# EasyEDA Pro project control_board.eprj

# Schematic Schematic1

## Sheets
1 P1: Board Name: Board1; Create Date: 2025-07-01; Page Name: P1; Project Name: control_board; Schematic Name: Schematic1; Update Date: 2025-07-02; Company: 嘉立创EDA; Page Size: A4; Version: V1.0
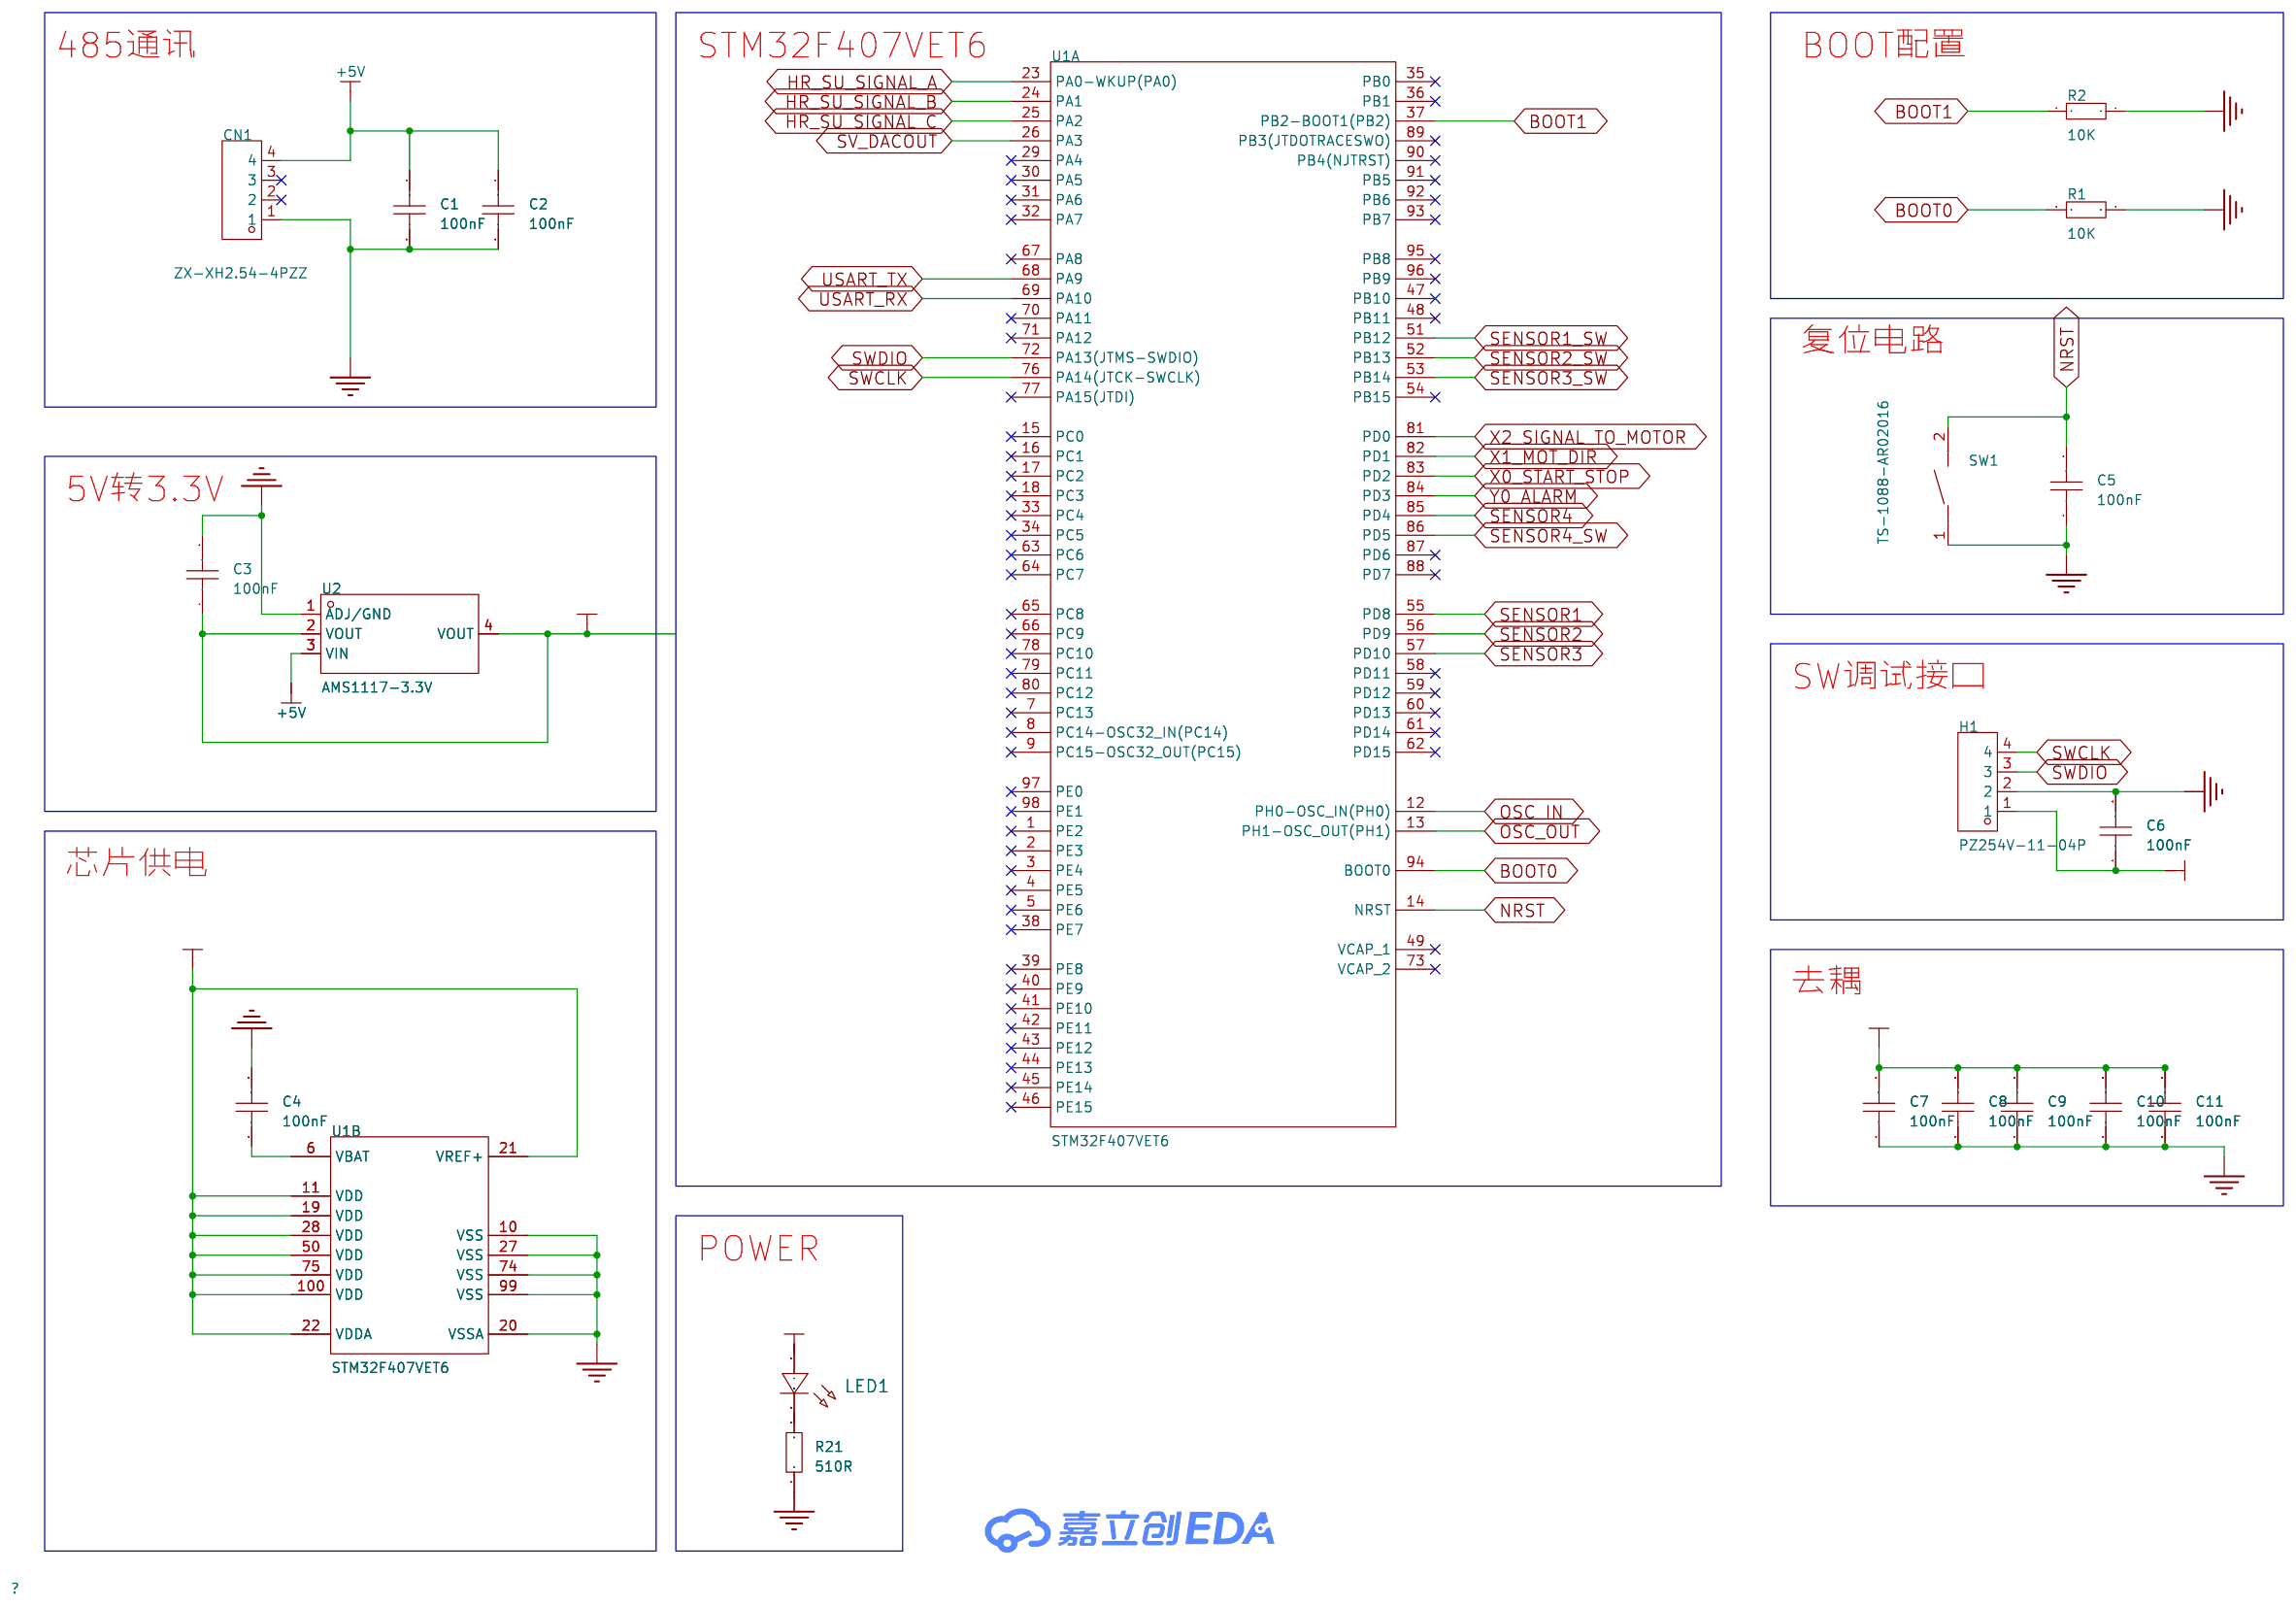
[diagram p0: P1]
2 P2: Page Name: P2
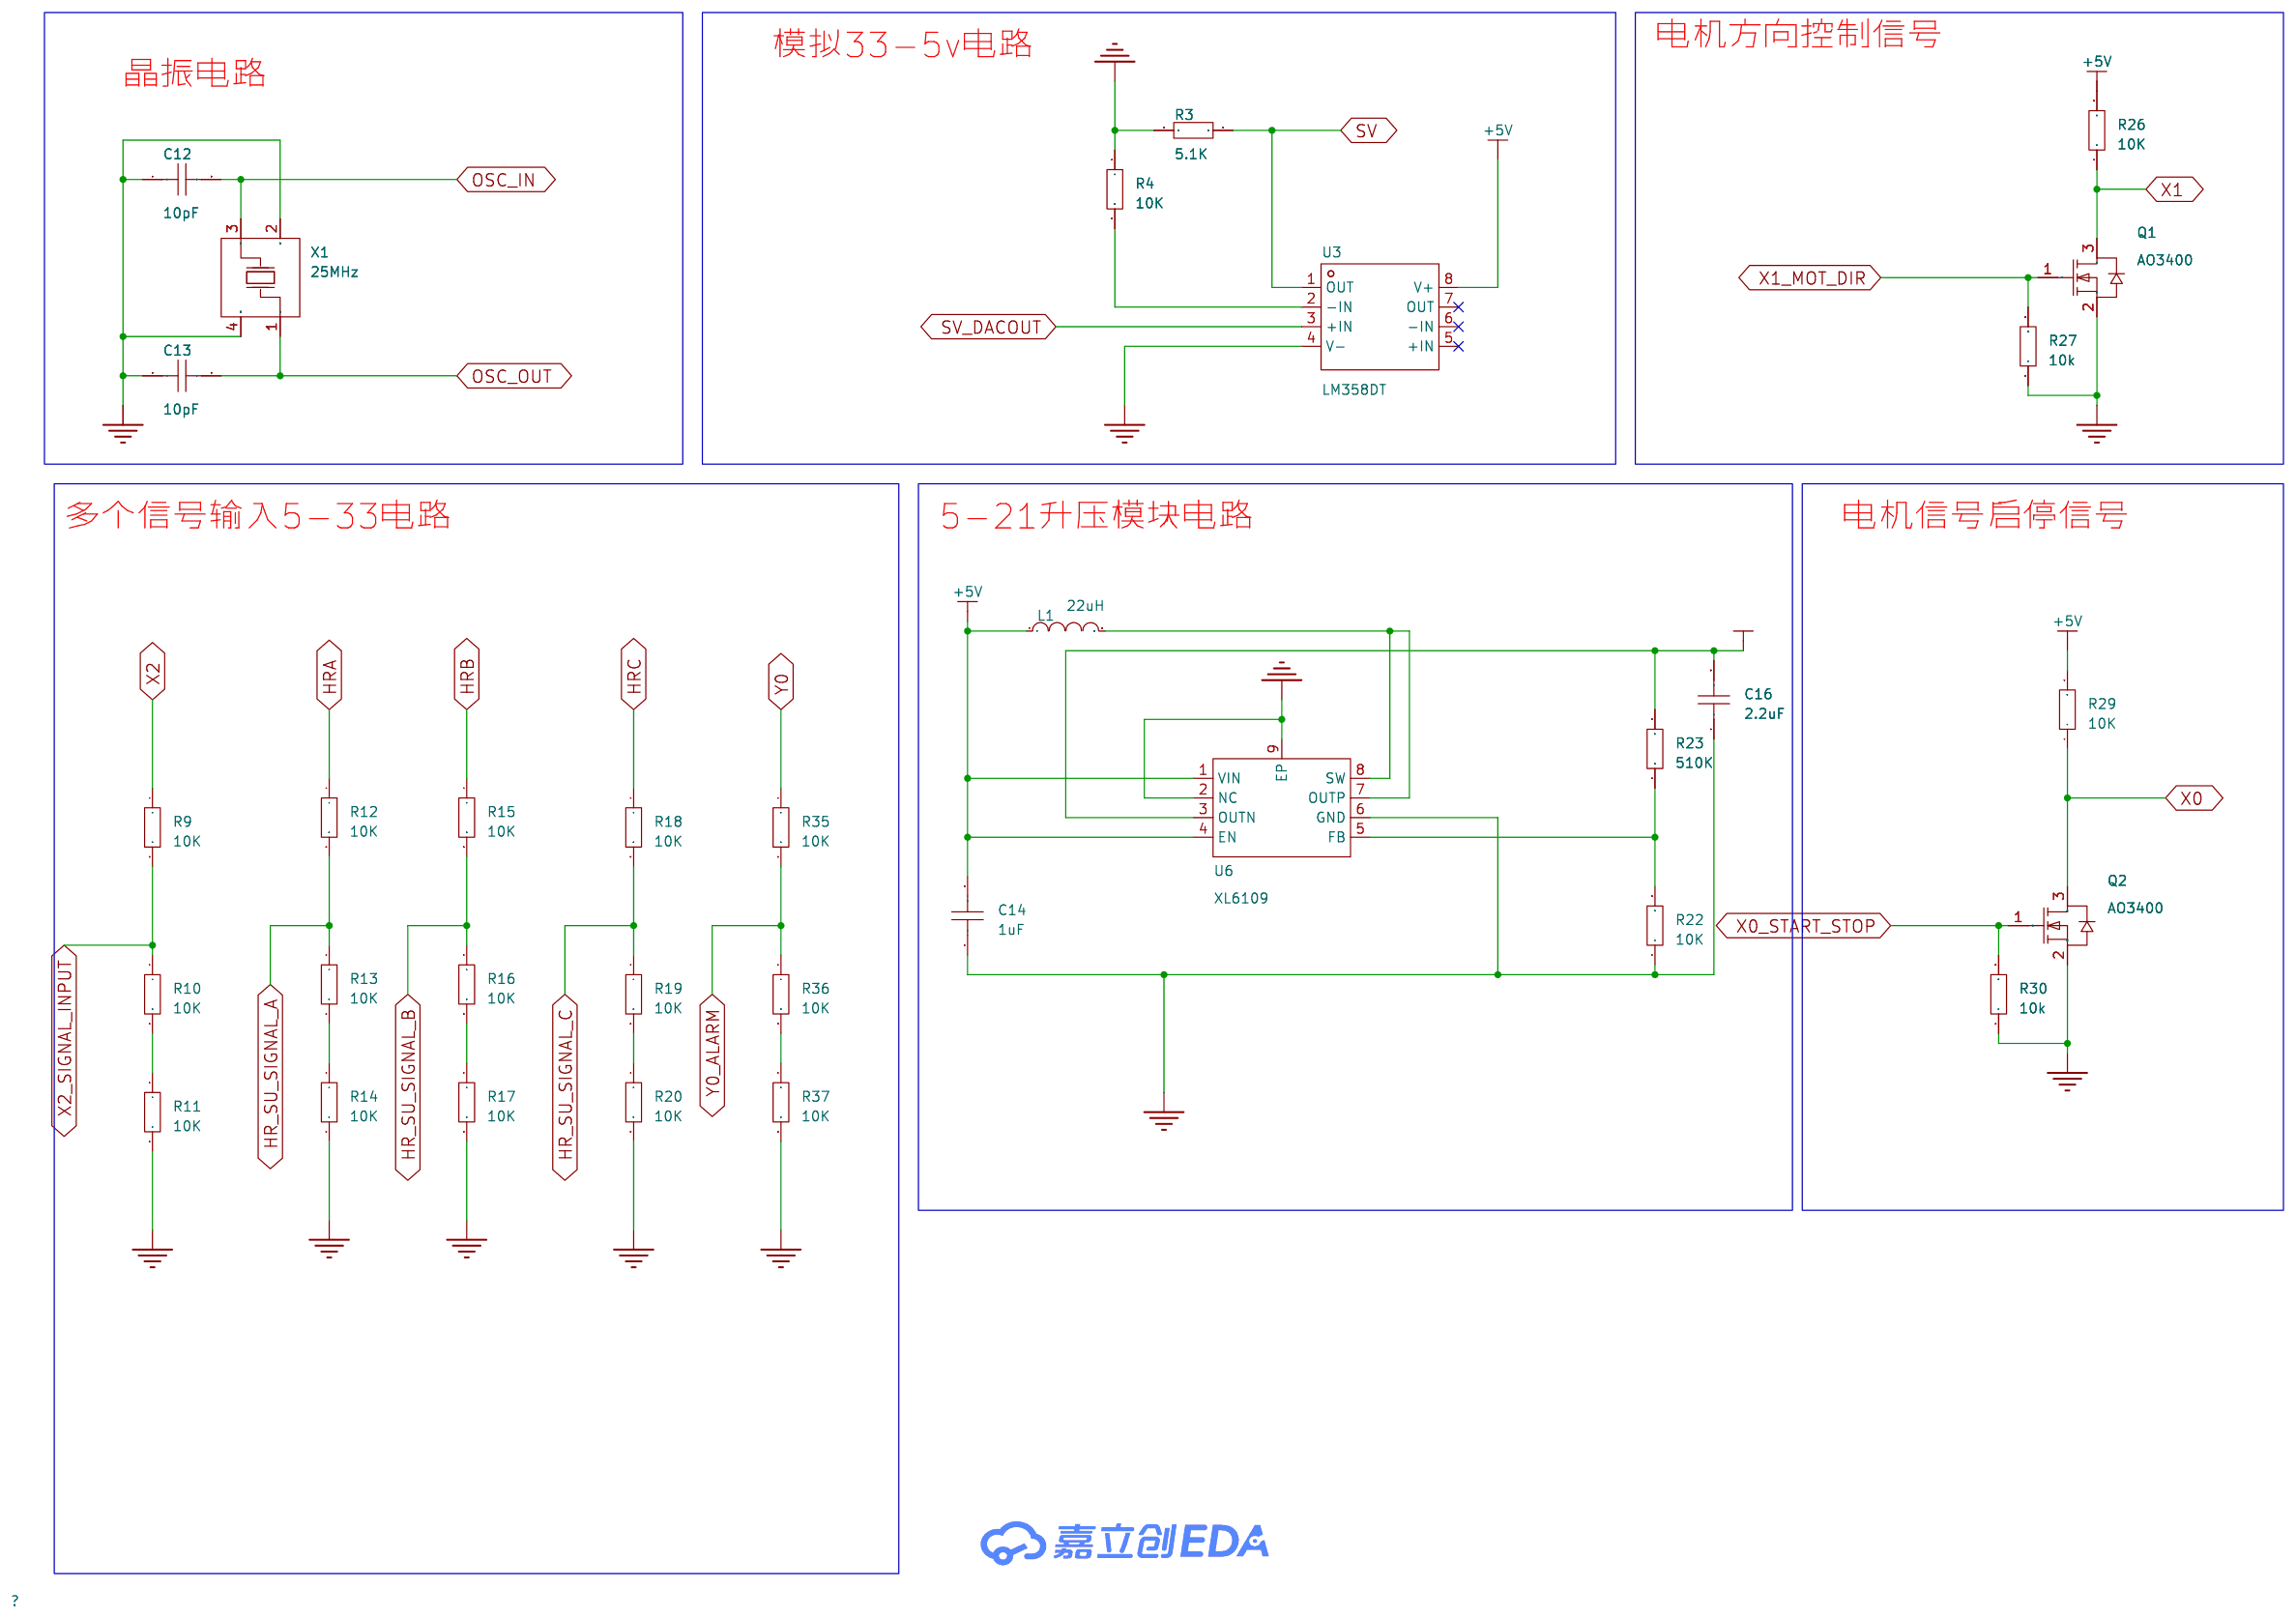
[diagram p1: P2]
3 P3: Create Date: 2025-07-02; Page Name: P3
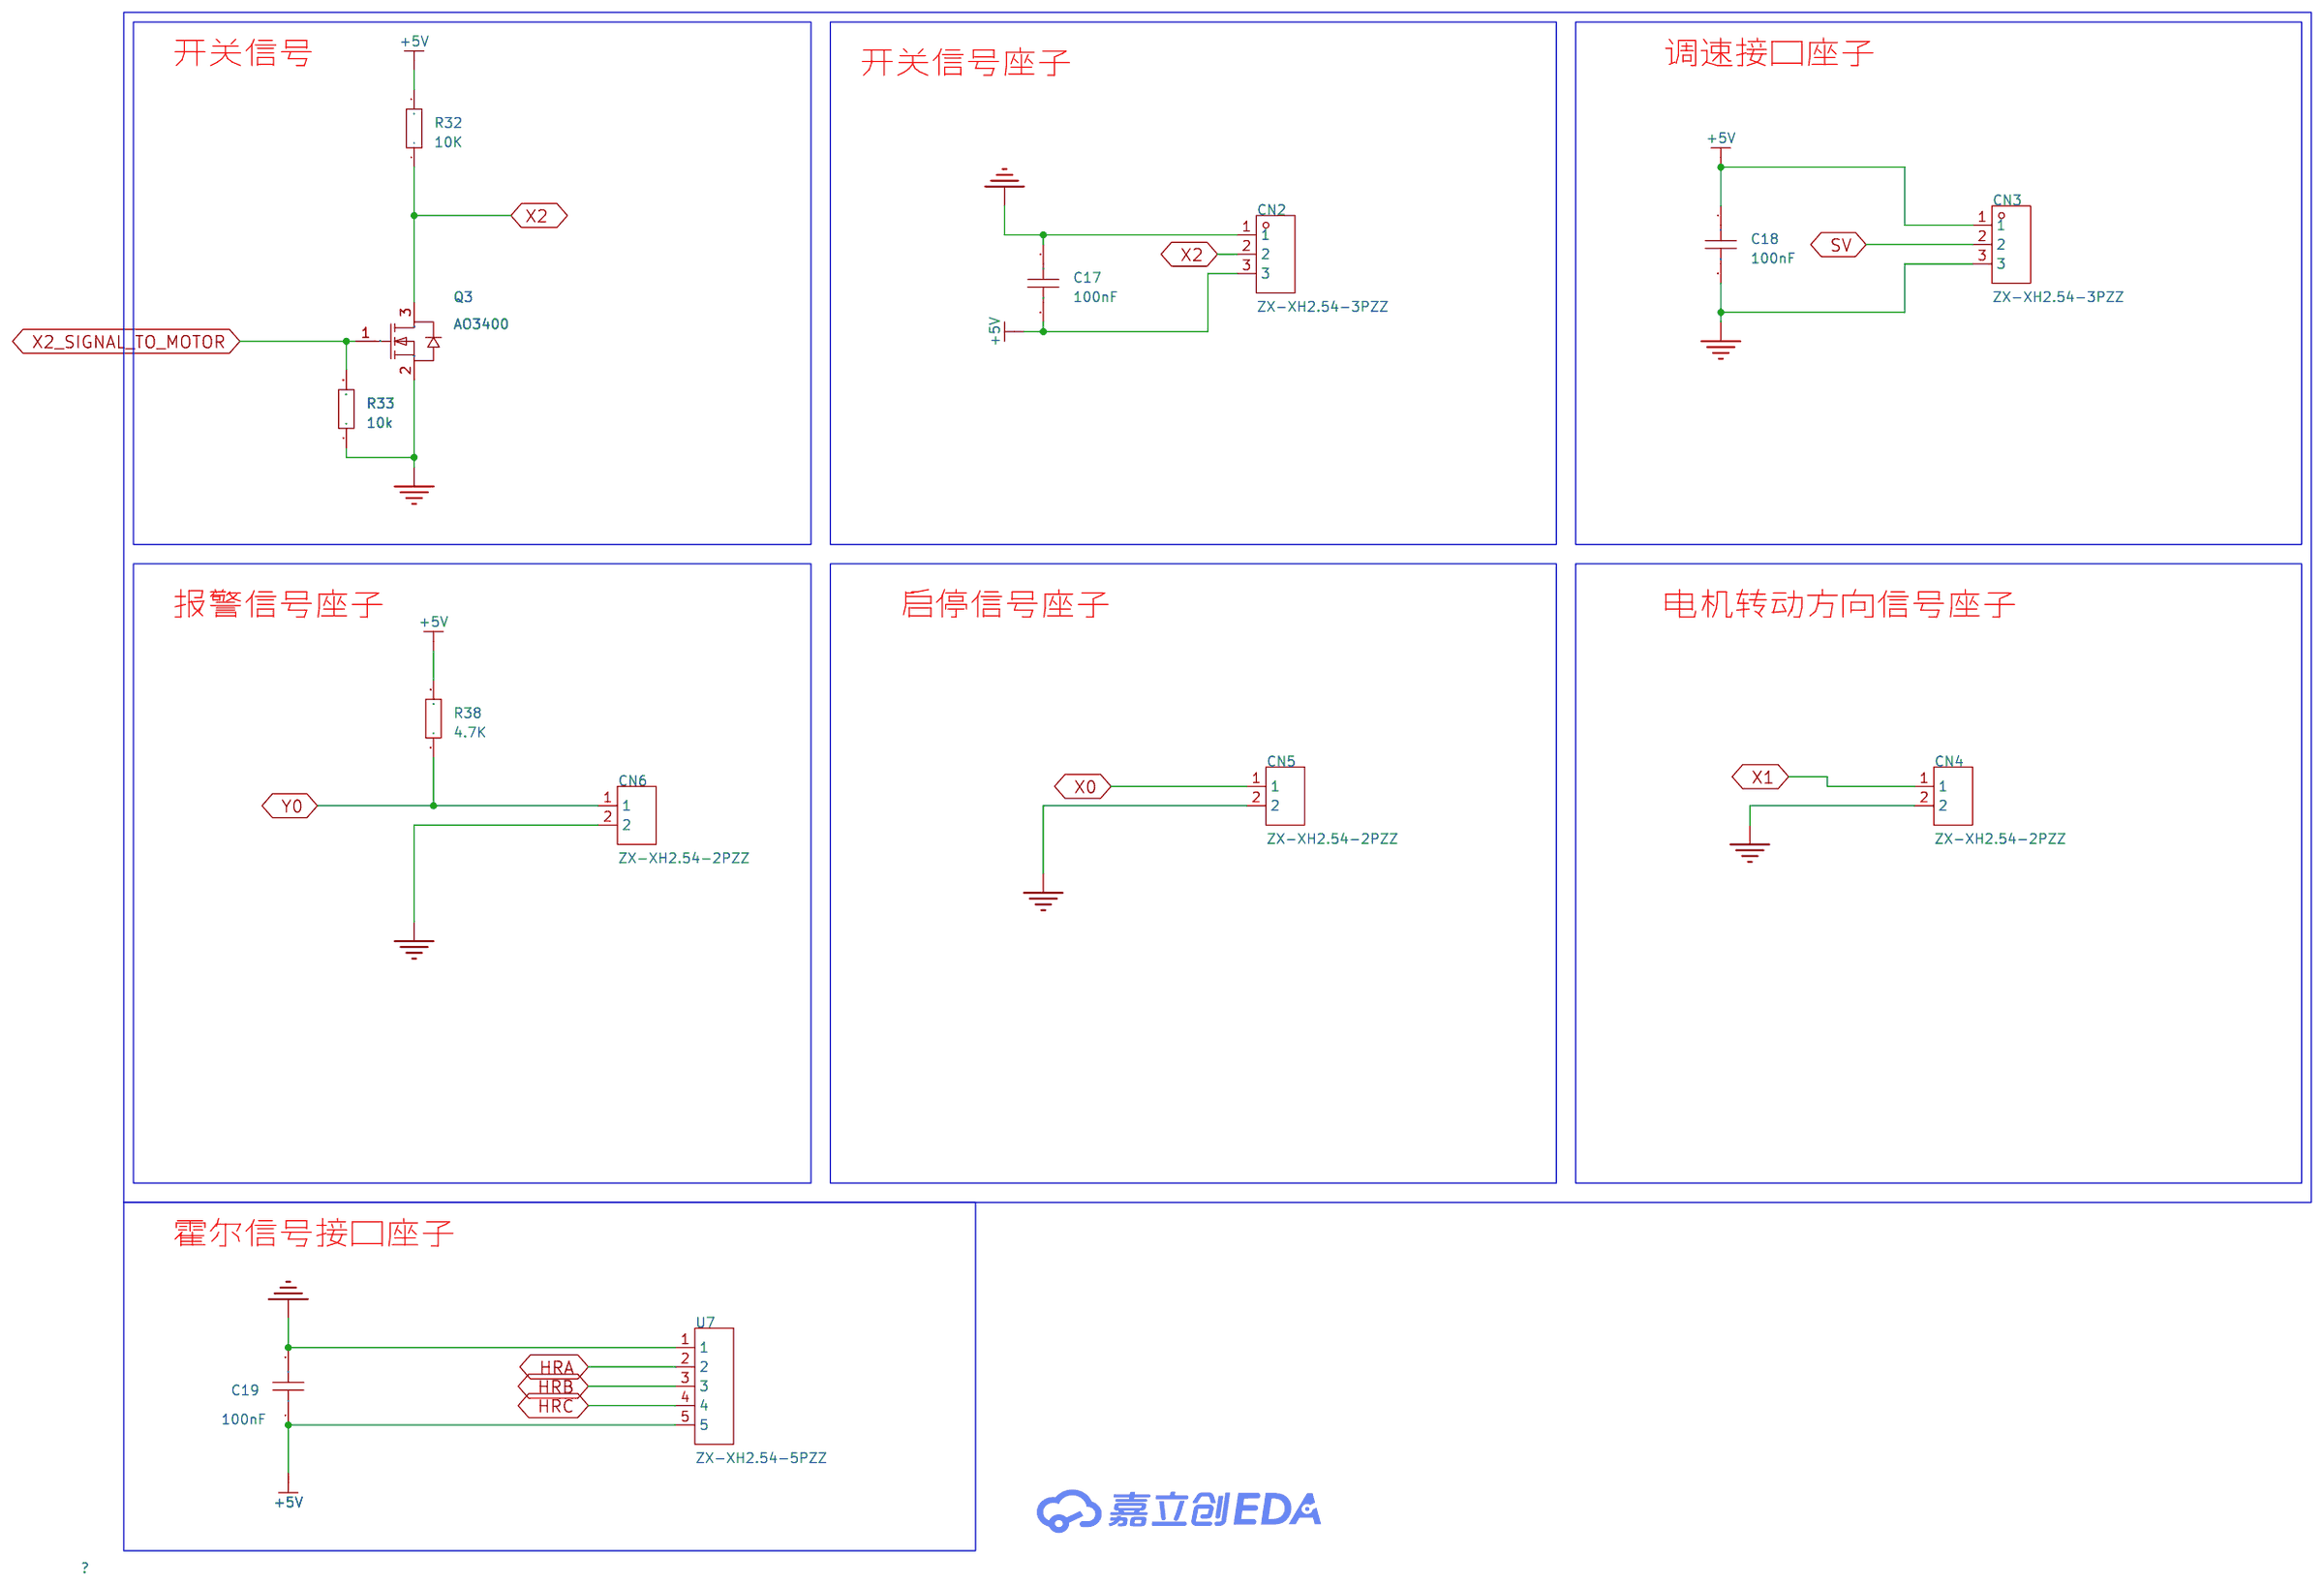
[diagram p2: P3]
4 P4: Create Date: 2025-07-02; Page Name: P4; Update Date: 2025-07-03
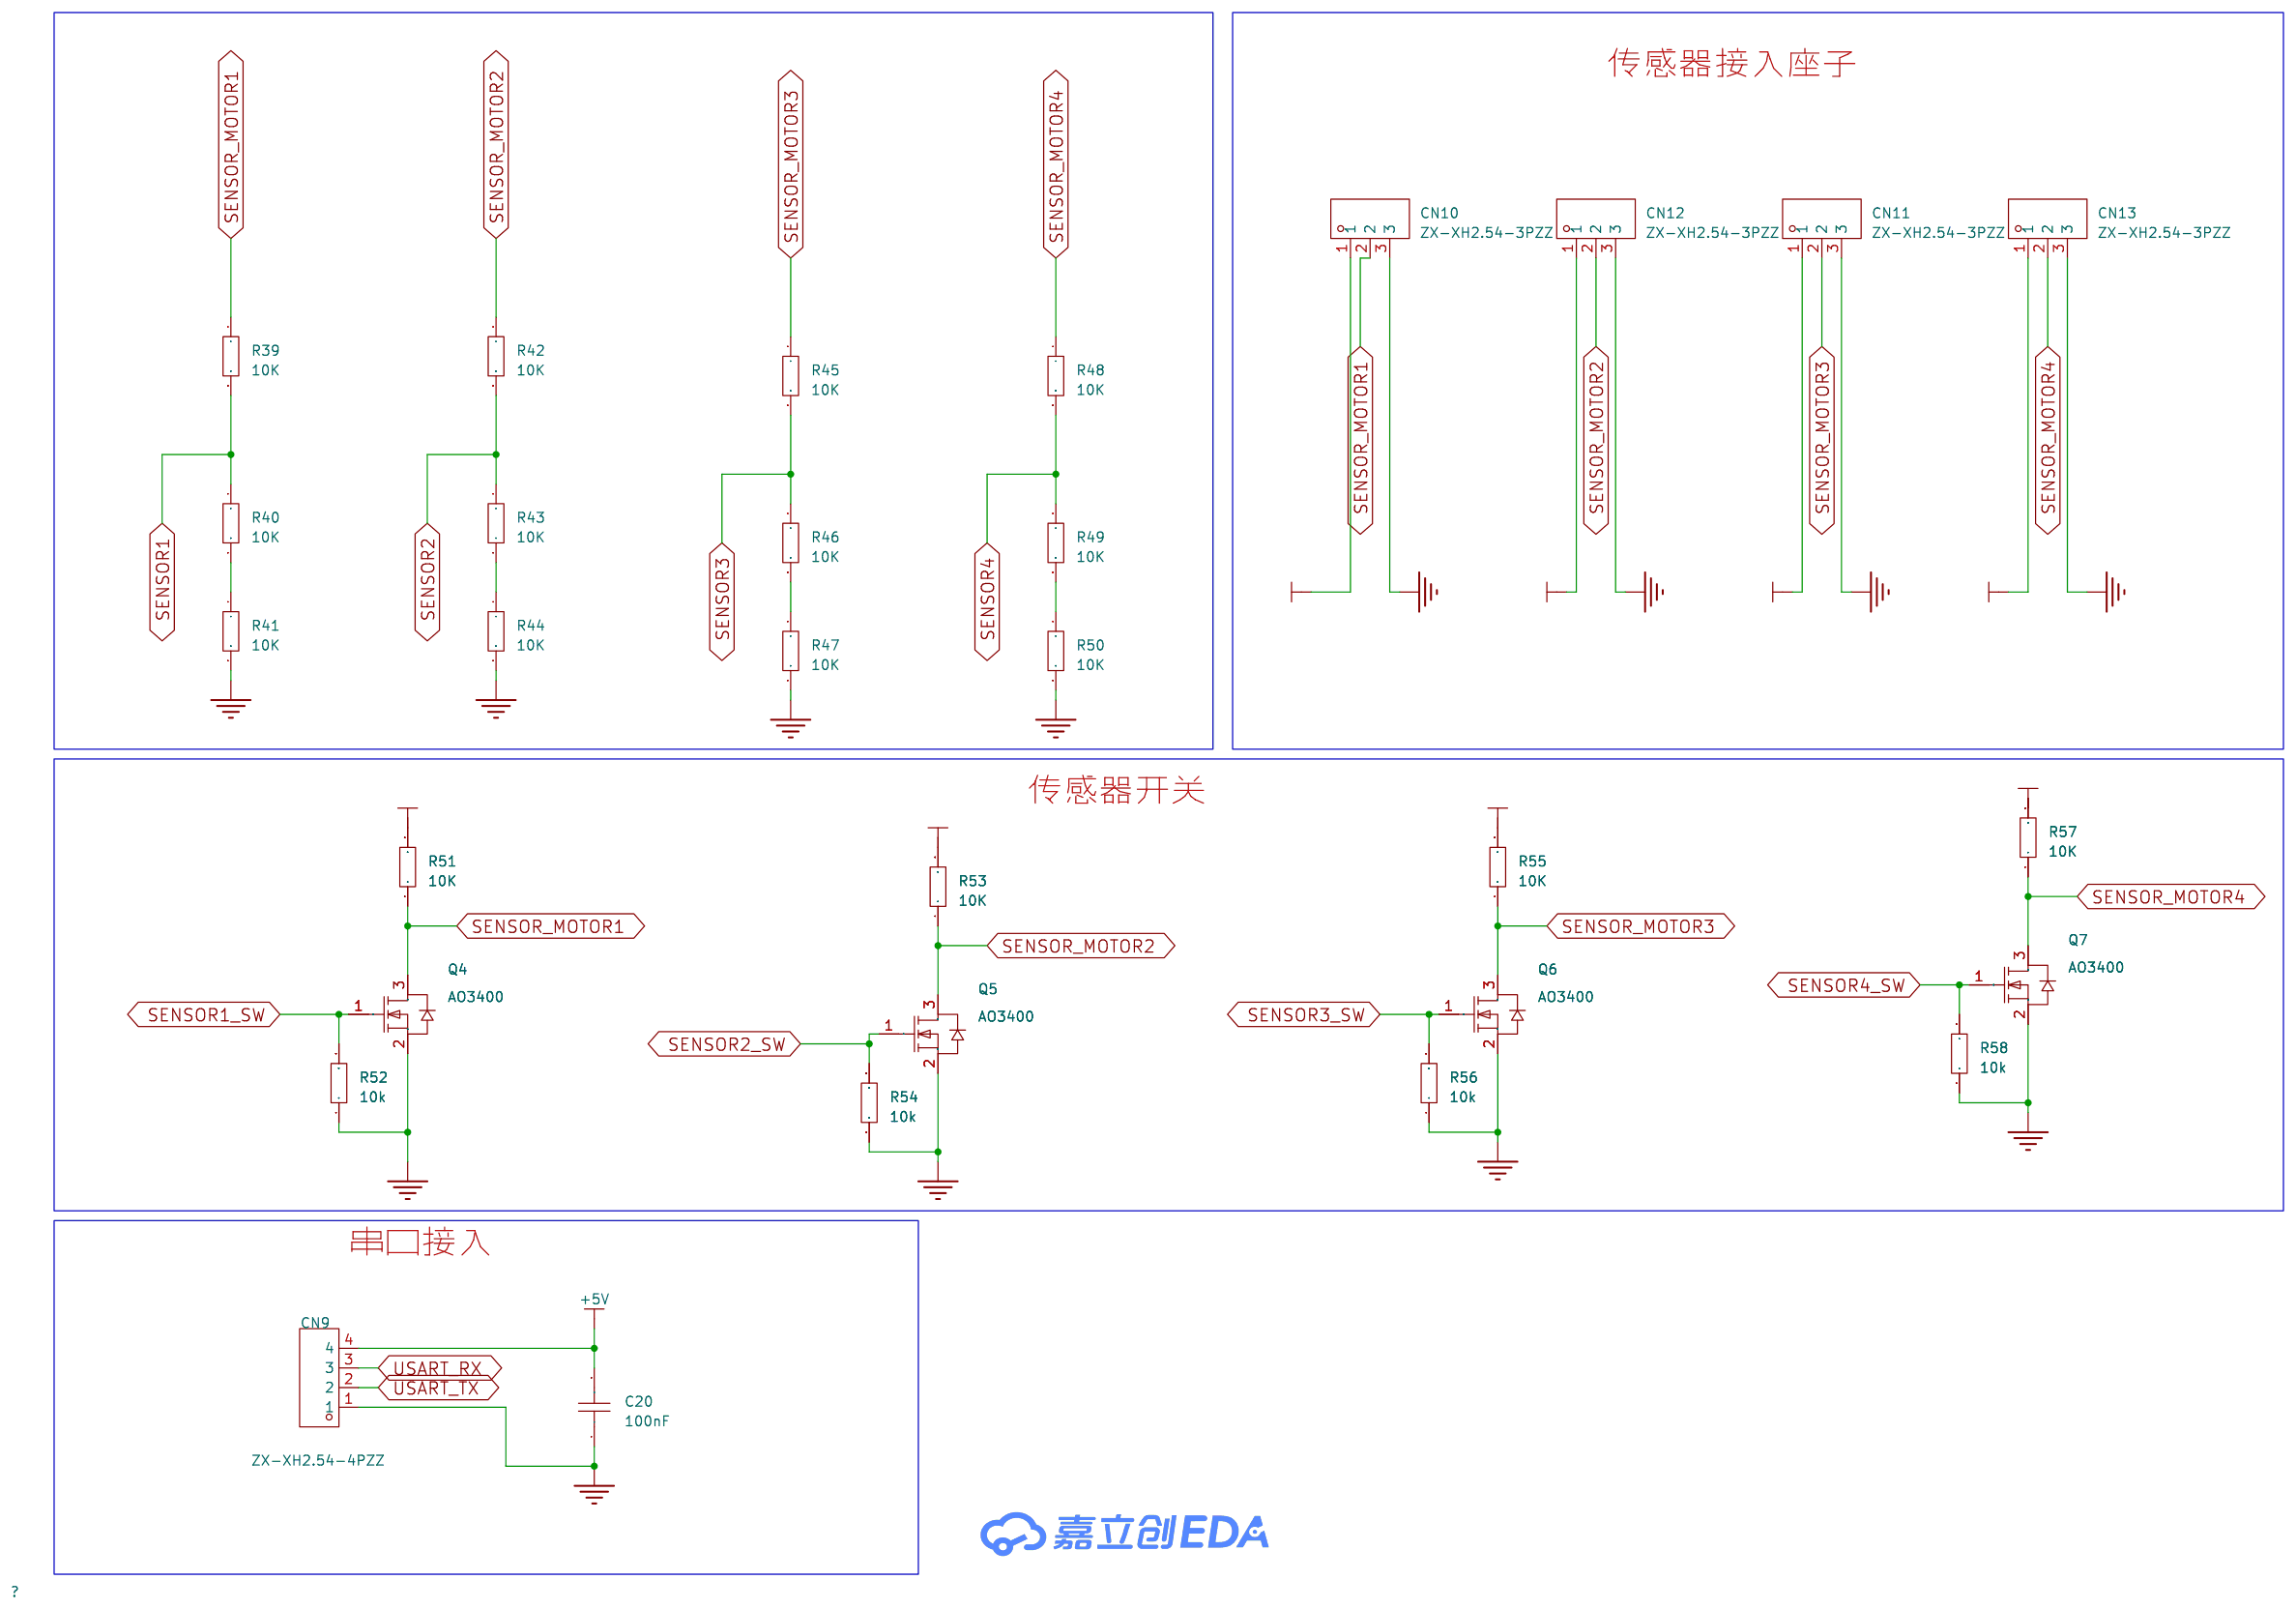
[diagram p3: P4]

## Parts
sheet P1
C1  100nF  [C0603]
C2  100nF  [C0603]
C3  100nF  [C0603]
C4  100nF  [C0603]
C5  100nF  [C0603]
C6  100nF  [C0603]
C7  100nF  [C0603]
C8  100nF  [C0603]
C9  100nF  [C0603]
C10  100nF  [C0603]
C11  100nF  [C0603]
CN1  ZX-XH2.54-4PZZ  [CONN-TH_4P-P2.50_4PIN]
H1  PZ254V-11-04P  [HDR-TH_4P-P2.54-V-M]
LED1  -  [LED_0603]
R1  10K  [R0603]
R2  10K  [R0603]
R21  510R  [R0603]
SW1  TS-1088-AR02016  [SW-SMD_L3.9-W3.0-P4.45]
U1  STM32F407VET6  [LQFP-100_L14.0-W14.0-P0.50-LS16.0-BL]  (sections 1,2)
U2  AMS1117-3.3V  [SOT-223-4_L6.5-W3.5-P2.30-LS7.0-TR]
sheet P2
C12  10pF  [C0603]
C13  10pF  [C0603]
C14  1uF  [C0603]
C16  2.2uF  [C0603]
L1  22uH  [L0603]
Q1  AO3400  [SOT-23_L2.9-W1.3-P1.90-LS2.4-BR]
Q2  AO3400  [SOT-23_L2.9-W1.3-P1.90-LS2.4-BR]
R3  5.1K  [R0603]
R4  10K  [R0603]
R9  10K  [R0603]
R10  10K  [R0603]
R11  10K  [R0603]
R12  10K  [R0603]
R13  10K  [R0603]
R14  10K  [R0603]
R15  10K  [R0603]
R16  10K  [R0603]
R17  10K  [R0603]
R18  10K  [R0603]
R19  10K  [R0603]
R20  10K  [R0603]
R22  10K  [R0603]
R23  510K  [R0603]
R26  10K  [R0603]
R27  10k  [R0603]
R29  10K  [R0603]
R30  10k  [R0603]
R35  10K  [R0603]
R36  10K  [R0603]
R37  10K  [R0603]
U3  LM358DT  [SOIC-8_L5.0-W4.0-P1.27-LS6.0-BL]
U6  XL6109  [DFN-8_L3.0-W3.0-P0.50-TL-EP2.1]
X1  25MHz  [CRYSTAL-SMD_4P-L3.2-W2.5-BL]
sheet P3
C17  100nF  [C0603]
C18  100nF  [C0603]
C19  100nF  [C0603]
CN2  ZX-XH2.54-3PZZ  [CONN-TH_3P-P2.54_2501S-3P]
CN3  ZX-XH2.54-3PZZ  [CONN-TH_3P-P2.54_2501S-3P]
CN4  ZX-XH2.54-2PZZ  [CONN-TH_2P-P2.50_HX25003-2A]
CN5  ZX-XH2.54-2PZZ  [CONN-TH_2P-P2.50_HX25003-2A]
CN6  ZX-XH2.54-2PZZ  [CONN-TH_2P-P2.50_HX25003-2A]
Q3  AO3400  [SOT-23_L2.9-W1.3-P1.90-LS2.4-BR]
R32  10K  [R0603]
R33  10k  [R0603]
R38  4.7K  [R0603]
U7  ZX-XH2.54-5PZZ  [CONN-TH_5P-P2.50_ZX-XH2.54-5PZZ]
sheet P4
C20  100nF  [C0603]
CN9  ZX-XH2.54-4PZZ  [CONN-TH_4P-P2.50_4PIN]
CN10  ZX-XH2.54-3PZZ  [CONN-TH_3P-P2.54_2501S-3P]
CN11  ZX-XH2.54-3PZZ  [CONN-TH_3P-P2.54_2501S-3P]
CN12  ZX-XH2.54-3PZZ  [CONN-TH_3P-P2.54_2501S-3P]
CN13  ZX-XH2.54-3PZZ  [CONN-TH_3P-P2.54_2501S-3P]
Q4  AO3400  [SOT-23_L2.9-W1.3-P1.90-LS2.4-BR]
Q5  AO3400  [SOT-23_L2.9-W1.3-P1.90-LS2.4-BR]
Q6  AO3400  [SOT-23_L2.9-W1.3-P1.90-LS2.4-BR]
Q7  AO3400  [SOT-23_L2.9-W1.3-P1.90-LS2.4-BR]
R39  10K  [R0603]
R40  10K  [R0603]
R41  10K  [R0603]
R42  10K  [R0603]
R43  10K  [R0603]
R44  10K  [R0603]
R45  10K  [R0603]
R46  10K  [R0603]
R47  10K  [R0603]
R48  10K  [R0603]
R49  10K  [R0603]
R50  10K  [R0603]
R51  10K  [R0603]
R52  10k  [R0603]
R53  10K  [R0603]
R54  10k  [R0603]
R55  10K  [R0603]
R56  10k  [R0603]
R57  10K  [R0603]
R58  10k  [R0603]

## Library data of the parts
C1-C14 C16-C20 = CAP_0603: Supplier Footprint: 0603
CN1 CN9 = ZX-XH2.54-4PZZ: LCSC Part Name: 1x4P 间距:2.5mm 直插 系列:XH; Supplier Part: C7429634; Manufacturer: Megastar(兆星); Supplier Footprint: 插件,P=2.5mm; JLCPCB Part Class: 扩展库; Datasheet: https://atta.szlcsc.com/upload/public/pdf/source/20230619/B529A2163E0159A644AB3383D208FB03.pdf; Supplier: LCSC; Pins Structure: 1x4P; Pitch: 2.5mm; Mounting Type: 直插; Reference Series: XH; Number of Pins: 4P; Number of Rows: 1; Number of PINs Per Row: 4; Rated Current: 3A; Contact Material: 黄铜; Contact Plating: 锡; Operating Temperature: -25℃~+85℃; Rated Voltage (Max): 250V; Plastic Material: PA66; Flame Retardant Rating: UL94V-0; Color: 白色; Z-Height of the Board: 7mm; X-Length of Bottom Edge on Board (Spacing Line): 12.5mm; Y-Width of Bottom Edge on Board: 5.9mm
H1 = PZ254V-11-04P: LCSC Part Name: 间距:2.54mm 1x4P 直插 方针; Supplier Part: C2691448; Manufacturer: XFCN(兴飞); Supplier Footprint: 插件,P=2.54mm; JLCPCB Part Class: 扩展库; Datasheet: https://atta.szlcsc.com/upload/public/pdf/source/20200309/C492403_F9F19131791D08044AD4F84F8E751A34.pdf; Supplier: LCSC; Pin Structure: 1x4P; Pitch: 2.54mm; Circluar Pins/Square Pins: 方针; Mounting Type: 直插; Number of Rows: 单排; Number of Pins: 4P; Current Rating (Max): 3A; Voltage Rating (Max): 250V; Length of Mating Pin: 6mm; Insulation Height: 2.5mm; Length of End Connection Pin: 3mm; Operating Temperature Range: -40℃~+105℃; Color: 黑色
LED1 = LED_0603-R: Supplier Footprint: 0603
R1-R4 R9-R23 R26 R27 R29 R30 R32 R33 R35-R58 = Res_0603: Supplier Footprint: 0603
SW1 = TS-1088-AR02016: LCSC Part Name: 4*3*2mm 立贴 轻触开关; Supplier Part: C720477; Manufacturer: XUNPU(讯普); Supplier Footprint: SMD; JLCPCB Part Class: 基础库; Datasheet: https://atta.szlcsc.com/upload/public/pdf/source/20200810/C720475_60D09DD6C54279ADDB2DC25100F1CC11.pdf; Supplier: LCSC; Circuit: 单刀单掷; Actuator Style: 圆形按钮; Operating Force: 160gf; Mounting Style: 立贴; Switch Length: 4mm; Switch Width: 3mm; Switch Height: 2mm; Strike Gundam: 不带; Contact Current: 50mA; Voltage Rating (DC): 12V; Insulation Resistance: 100MΩ; Actuator/Cap Color: 黑色; Pin Style: SMD接片; Mechanical Life: 10万次; Operating Temperature: -30℃~+80℃
U1 = STM32F407VET6: LCSC Part Name: 带DSP和FPU的高性能基础系列ARM Cortex-M4 MCU，具有512 KB Flash、168 MHz CPU、ART加速器、以太网和FSMC; Supplier Part: C28730; Manufacturer: ST(意法半导体); Supplier Footprint: LQFP-100(14x14); JLCPCB Part Class: 扩展库; Datasheet: https://atta.szlcsc.com/upload/public/pdf/source/20140801/1457707197138.pdf; Supplier: LCSC; CPU Core: ARM-M4; CPU Maximum Speed: 168MHz; Program Storage Size: 512KB; Program Memory Type: FLASH; Number of I/O: 82; ADC (Bit): 12bit; DAC (Bit): 12bit; Voltage - Supply: 1.8V~3.6V
U2 = AMS1117-3.3V: LCSC Part Name: 输入18V 输出3.3V 1A; Supplier Part: C5120765; Manufacturer: MSKSEMI(美森科); Supplier Footprint: SOT-223; JLCPCB Part Class: 扩展库; Datasheet: https://atta.szlcsc.com/upload/public/pdf/source/20230802/7000FCAFF33971783A269E7BD69EFE08.pdf; Supplier: LCSC; Output Type: 固定; Maximum Input Voltage: 18V; Output Voltage: 3.3V; MAX Output Current: 1A; Dropout Voltage: 1.4V@(1A); standby current: 12mA; Operating Temperature: 0℃~+125℃; Output Polarity: 正极; Number of Outputs: 1
L1 = L_0603
Q1-Q7 = AO3400_C2938367: LCSC Part Name: 1个N沟道 耐压:30V 电流:5.8A; Supplier Part: C2938367; Manufacturer: GOODWORK(固得沃克); Supplier Footprint: SOT-23; JLCPCB Part Class: 扩展库; Datasheet: https://atta.szlcsc.com/upload/public/pdf/source/20240805/AF56525E67E43DBB802F95DDDF058BE9.pdf; Supplier: LCSC; Type: 1个N沟道; Drain to Source Voltage: 30V; Current - Continuous Drain(Id): 5.8A; RDS(on): 52mΩ@2.5V,4A; Pd - Power Dissipation: 1.5W; Gate Threshold Voltage (Vgs(th)@Id): 700mV; Input Capacitance(Ciss@Vds): 1.05nF; Reverse Transfer Capacitance (Crss@Vds): 77pF; Operating Temperature: -55℃~+150℃
U3 = LM358DT: LCSC Part Name: 低功耗双运算放大器，低输入偏置电流; Supplier Part: C9418; Manufacturer: ST(意法半导体); Supplier Footprint: SOIC-8; JLCPCB Part Class: 扩展库; Datasheet: https://atta.szlcsc.com/upload/public/pdf/source/20210324/C2649392_3AC2EBDF95F7F5F1B944475B4862C799.pdf; Supplier: LCSC; Number of Channels: 双路; Maximum Power Supply Range (Vdd-Vss): 32V; Vos - Input Offset Voltage: 7mV; Input Offset Voltage Drift(Vos TC): 30uV/℃; Slew Rate: 600V/ms; Ib - Input Bias Current: 200nA; Noise density(eN): 55nV/√Hz@1kHz; Common Mode Rejection Ratio(CMRR): 85dB; Operating Temperature: 0℃~+70℃; Single supply: 3V~30V
U6 = XL6109: Supplier Part: C48031577; Manufacturer: XLSEMI(芯龙); Supplier Footprint: PDFN-8L(3x3); JLCPCB Part Class: 扩展库; Datasheet: https://atta.szlcsc.com/upload/public/pdf/source/20250416/77F5C151C7A467163D45EDD3B641A0F7.pdf; Supplier: LCSC
X1 = X322525MOB4SI: LCSC Part Name: YSX321SL 25MHZ 4P 3225 12PF ±10PPM -40~85℃ (±20PPM); Supplier Part: C9006; Manufacturer: YXC(扬兴晶振); Supplier Footprint: SMD3225-4P; JLCPCB Part Class: 基础库; Datasheet: https://atta.szlcsc.com/upload/public/pdf/source/20240329/19D5F850207469550BEB00D7DFEDBC7A.pdf; Supplier: LCSC; Type: 贴片晶振; Normal temperature Frequency Tolerance: ±10ppm; Load Capacitance: 12pF; Frequency Stability: ±20ppm; Operating Temperature: -40℃~+85℃
CN2 CN3 CN10-CN13 = ZX-XH2.54-3PZZ: LCSC Part Name: 1x3P 间距:2.5mm 直插 系列:XH; Supplier Part: C7429633; Manufacturer: Megastar(兆星); Supplier Footprint: 插件,P=2.5mm; JLCPCB Part Class: 扩展库; Datasheet: https://atta.szlcsc.com/upload/public/pdf/source/20230619/AE17037A2CFDBE8D9CBA775D61AD0A84.pdf; Supplier: LCSC; Pins Structure: 1x3P; Pitch: 2.5mm; Mounting Type: 直插; Reference Series: XH; Number of Pins: 3P; Number of Rows: 1; Number of PINs Per Row: 3; Rated Current: 3A; Contact Material: 黄铜; Contact Plating: 锡; Operating Temperature: -25℃~+85℃; Rated Voltage (Max): 250V; Plastic Material: PA66; Flame Retardant Rating: UL94V-0; Color: 白色; Z-Height of the Board: 7mm; X-Length of Bottom Edge on Board (Spacing Line): 10mm; Y-Width of Bottom Edge on Board: 5.9mm
CN4-CN6 = ZX-XH2.54-2PZZ: LCSC Part Name: 1x2P 间距:2.5mm 直插 系列:XH; Supplier Part: C7429632; Manufacturer: Megastar(兆星); Supplier Footprint: 插件,P=2.5mm; JLCPCB Part Class: 扩展库; Datasheet: https://atta.szlcsc.com/upload/public/pdf/source/20230619/19BA6947230AA44A04D3EDD65E618FD0.pdf; Supplier: LCSC; Pins Structure: 1x2P; Pitch: 2.5mm; Mounting Type: 直插; Reference Series: XH; Number of Pins: 2P; Number of Rows: 1; Number of PINs Per Row: 2; Rated Current: 3A; Contact Material: 黄铜; Contact Plating: 锡; Operating Temperature: -25℃~+85℃; Rated Voltage (Max): 250V; Plastic Material: PA66; Flame Retardant Rating: UL94V-0; Color: 白色; Z-Height of the Board: 7mm; X-Length of Bottom Edge on Board (Spacing Line): 7.5mm; Y-Width of Bottom Edge on Board: 5.9mm
U7 = ZX-XH2.54-5PZZ: LCSC Part Name: 1x5P 间距:2.5mm 直插 系列:XH; Supplier Part: C7429635; Manufacturer: Megastar(兆星); Supplier Footprint: 插件,P=2.5mm; JLCPCB Part Class: 扩展库; Datasheet: https://atta.szlcsc.com/upload/public/pdf/source/20230619/60EEF4ADD558E90BFFACF5D939816781.pdf; Supplier: LCSC; Pins Structure: 1x5P; Pitch: 2.5mm; Mounting Type: 直插; Reference Series: XH; Number of Pins: 5P; Number of Rows: 1; Number of PINs Per Row: 5; Current Rating: 3A; Contact Material: 黄铜; Contact Plating: 锡; Operating Temperature: -25℃~+85℃; Voltage Rating: 250V; Plastic Material: PA66; Flame Retardant Rating: UL94V-0; Color: 白色; Z-Height of the Board: 7mm; X-Length of Bottom Edge on Board (Spacing Line): 15mm; Y-Width of Bottom Edge on Board: 5.9mm

## Nets
+5V: C1.1 C2.1 C14.2 C17.2 C18.1 C19.1 C20.2 CN1.4 CN2.3 CN3.1 CN9.4 L1.1 R26.2 R29.2 R32.2 R38.2 U2.3(VIN) U3.8(V+) U6.1(VIN) U6.4(EN) U7.5
GND: C1.2 C2.2 C3.2 C4.2 C5.1 C6.2 C7.1 C8.1 C9.1 C10.1 C11.1 C12.1 C13.1 C14.1 C16.1 C17.1 C18.2 C19.2 C20.1 CN1.1 CN2.1 CN3.3 CN4.2 CN5.2 CN6.2 CN9.1 CN10.3 CN11.3 CN12.3 CN13.3 H1.2 Q1.2(S) Q2.2(S) Q3.2(S) Q4.2(S) Q5.2(S) Q6.2(S) Q7.2(S) R1.1 R2.1 R3.1 R4.1 R11.2 R14.2 R17.2 R20.2 R21.1 R22.1 R27.1 R30.1 R33.1 R37.2 R41.2 R44.2 R47.2 R50.2 R52.1 R54.1 R56.1 R58.1 SW1.1 U1.10(VSS) U1.20(VSSA) U1.27(VSS) U1.74(VSS) U1.99(VSS) U2.1(ADJ/GND) U3.4(V-) U6.2(NC) U6.6(GND) U6.9(EP) U7.1 X1.2(GND) X1.4(GND)
VCC_3.3V: C3.1 C6.1 C7.2 C8.2 C9.2 C10.2 C11.2 H1.1 LED1.2(A) U1.11(VDD) U1.19(VDD) U1.21(VREF+) U1.22(VDDA) U1.28(VDD) U1.50(VDD) U1.75(VDD) U1.100(VDD) U2.2(VOUT) U2.4(VOUT)
VCC_21V: C16.2 CN10.1 CN11.1 CN12.1 CN13.1 R23.2 R51.2 R53.2 R55.2 R57.2 U6.3(OUTN)
BOOT0: R1.2 U1.94(BOOT0)
BOOT1: R2.2 U1.37(PB2-BOOT1(PB2))
HR_SU_SIGNAL_A: R12.2 R13.1 U1.23(PA0-WKUP(PA0))
HR_SU_SIGNAL_B: R15.2 R16.1 U1.24(PA1)
HR_SU_SIGNAL_C: R18.2 R19.1 U1.25(PA2)
HRA: R12.1 U7.2
HRB: R15.1 U7.3
HRC: R18.1 U7.4
NRST: C5.2 SW1.2 U1.14(NRST)
OSC_IN: C12.2 U1.12(PH0-OSC_IN(PH0)) X1.3(OSC2)
OSC_OUT: C13.2 U1.13(PH1-OSC_OUT(PH1)) X1.1(OSC1)
SENSOR1: R39.2 R40.1 U1.55(PD8)
SENSOR1_SW: Q4.1(G) R52.2 U1.51(PB12)
SENSOR2: R42.2 R43.1 U1.56(PD9)
SENSOR2_SW: Q5.1(G) R54.2 U1.52(PB13)
SENSOR3: R45.2 R46.1 U1.57(PD10)
SENSOR3_SW: Q6.1(G) R56.2 U1.53(PB14)
SENSOR4: R48.2 R49.1 U1.85(PD4)
SENSOR4_SW: Q7.1(G) R58.2 U1.86(PD5)
SENSOR_MOTOR1: CN10.2 Q4.3(D) R39.1 R51.1
SENSOR_MOTOR2: CN12.2 Q5.3(D) R42.1 R53.1
SENSOR_MOTOR3: CN11.2 Q6.3(D) R45.1 R55.1
SENSOR_MOTOR4: CN13.2 Q7.3(D) R48.1 R57.1
SV: CN3.2 R3.2 U3.1(OUT)
SV_DACOUT: U1.26(PA3) U3.3(+IN)
SWCLK: H1.4 U1.76(PA14(JTCK-SWCLK))
SWDIO: H1.3 U1.72(PA13(JTMS-SWDIO))
USART_RX: CN9.3 U1.69(PA10)
USART_TX: CN9.2 U1.68(PA9)
X0: CN5.1 Q2.3(D) R29.1
X0_START_STOP: Q2.1(G) R30.2 U1.83(PD2)
X1: CN4.1 Q1.3(D) R26.1
X1_MOT_DIR: Q1.1(G) R27.2 U1.82(PD1)
X2: CN2.2 Q3.3(D) R9.1 R32.1
X2_SIGNAL_INPUT: R9.2 R10.1
X2_SIGNAL_TO_MOTOR: Q3.1(G) R33.2 U1.81(PD0)
Y0: CN6.1 R35.1 R38.1
Y0_ALARM: R35.2 R36.1 U1.84(PD3)
$1N1908: C4.1 U1.6(VBAT)
$1N4124: LED1.1(C) R21.2
$2N1061: R4.2 U3.2(-IN)
$2N1709: R10.2 R11.1
$2N1843: R13.2 R14.1
$2N1940: R16.2 R17.1
$2N2037: R19.2 R20.1
$2N3321: R22.2 R23.1 U6.5(FB)
$2N3441: L1.2 U6.7(OUTP) U6.8(SW)
$2N4181: R36.2 R37.1
$4N232: R40.2 R41.1
$4N1207: R43.2 R44.1
$4N1320: R46.2 R47.1
$4N1433: R49.2 R50.1

Not connected (* = marked no-connect by the designer): CN1 2* 3*; U1 1(PE2)* 2(PE3)* 3(PE4)* 4(PE5)* 5(PE6)* 7(PC13)* 8(PC14-OSC32_IN(PC14))* 9(PC15-OSC32_OUT(PC15))* 15(PC0)* 16(PC1)* 17(PC2)* 18(PC3)* 29(PA4)* 30(PA5)* 31(PA6)* 32(PA7)* 33(PC4)* 34(PC5)* 35(PB0)* 36(PB1)* 38(PE7)* 39(PE8)* 40(PE9)* 41(PE10)* 42(PE11)* 43(PE12)* 44(PE13)* 45(PE14)* 46(PE15)* 47(PB10)* 48(PB11)* 49(VCAP_1)* 54(PB15)* 58(PD11)* 59(PD12)* 60(PD13)* 61(PD14)* 62(PD15)* 63(PC6)* 64(PC7)* 65(PC8)* 66(PC9)* 67(PA8)* 70(PA11)* 71(PA12)* 73(VCAP_2)* 77(PA15(JTDI))* 78(PC10)* 79(PC11)* 80(PC12)* 87(PD6)* 88(PD7)* 89(PB3(JTDOTRACESWO))* 90(PB4(NJTRST))* 91(PB5)* 92(PB6)* 93(PB7)* 95(PB8)* 96(PB9)* 97(PE0)* 98(PE1)*; U3 5(+IN)* 6(-IN)* 7(OUT)*

## Notes on the sheets
sheet 1
- 485通讯
- STM32F407VET6
- BOOT配置
- 复位电路
- 5V转3.3V
- SW调试接口
- 芯片供电
- 去耦
- POWER
sheet 2
- 模拟33-5v电路
- 电机方向控制信号
- 晶振电路
- 多个信号输入5-33电路
- 5-21升压模块电路
- 电机信号启停信号
sheet 3
- 开关信号
- 开关信号座子
- 调速接口座子
- 报警信号座子
- 启停信号座子
- 电机转动方向信号座子
- 霍尔信号接口座子
sheet 4
- 传感器接入座子
- 传感器开关
- 串口接入

# Board PCB1
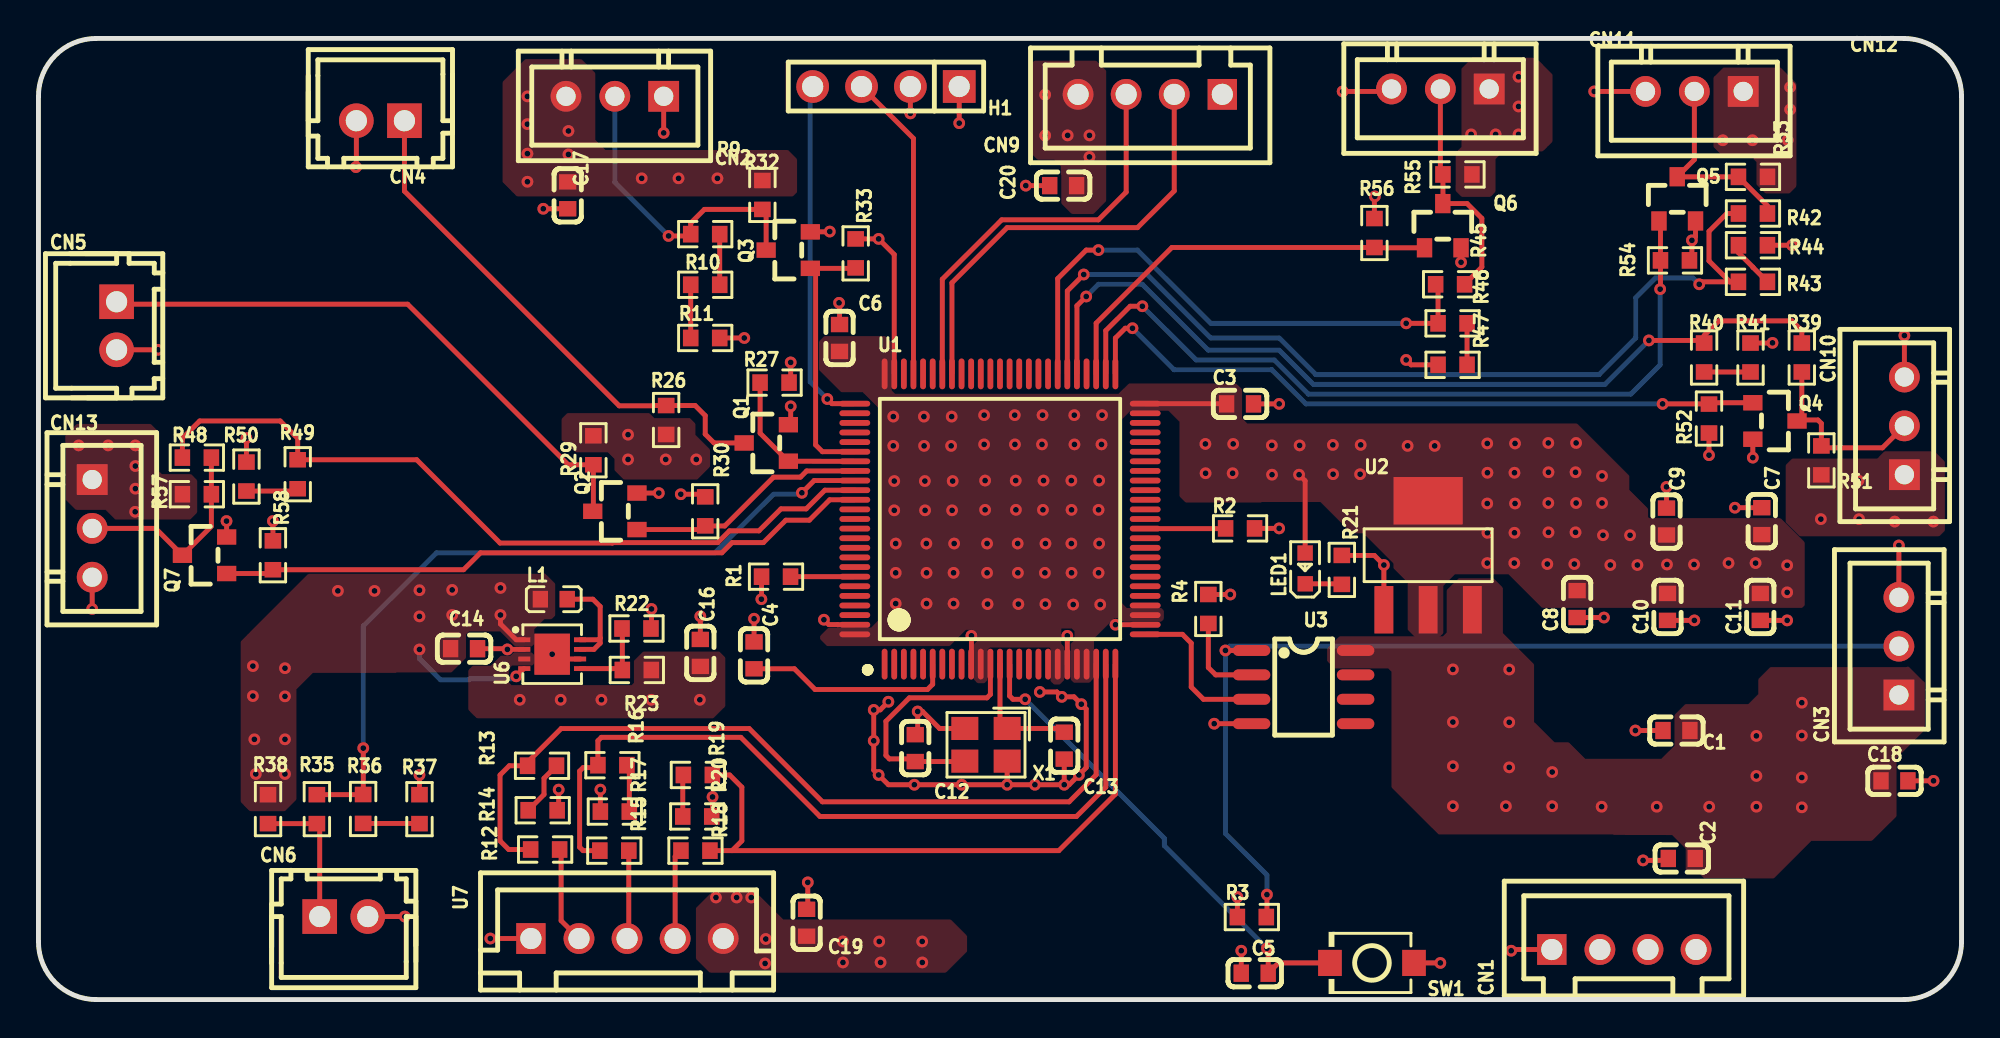
[diagram p4: board, top side]
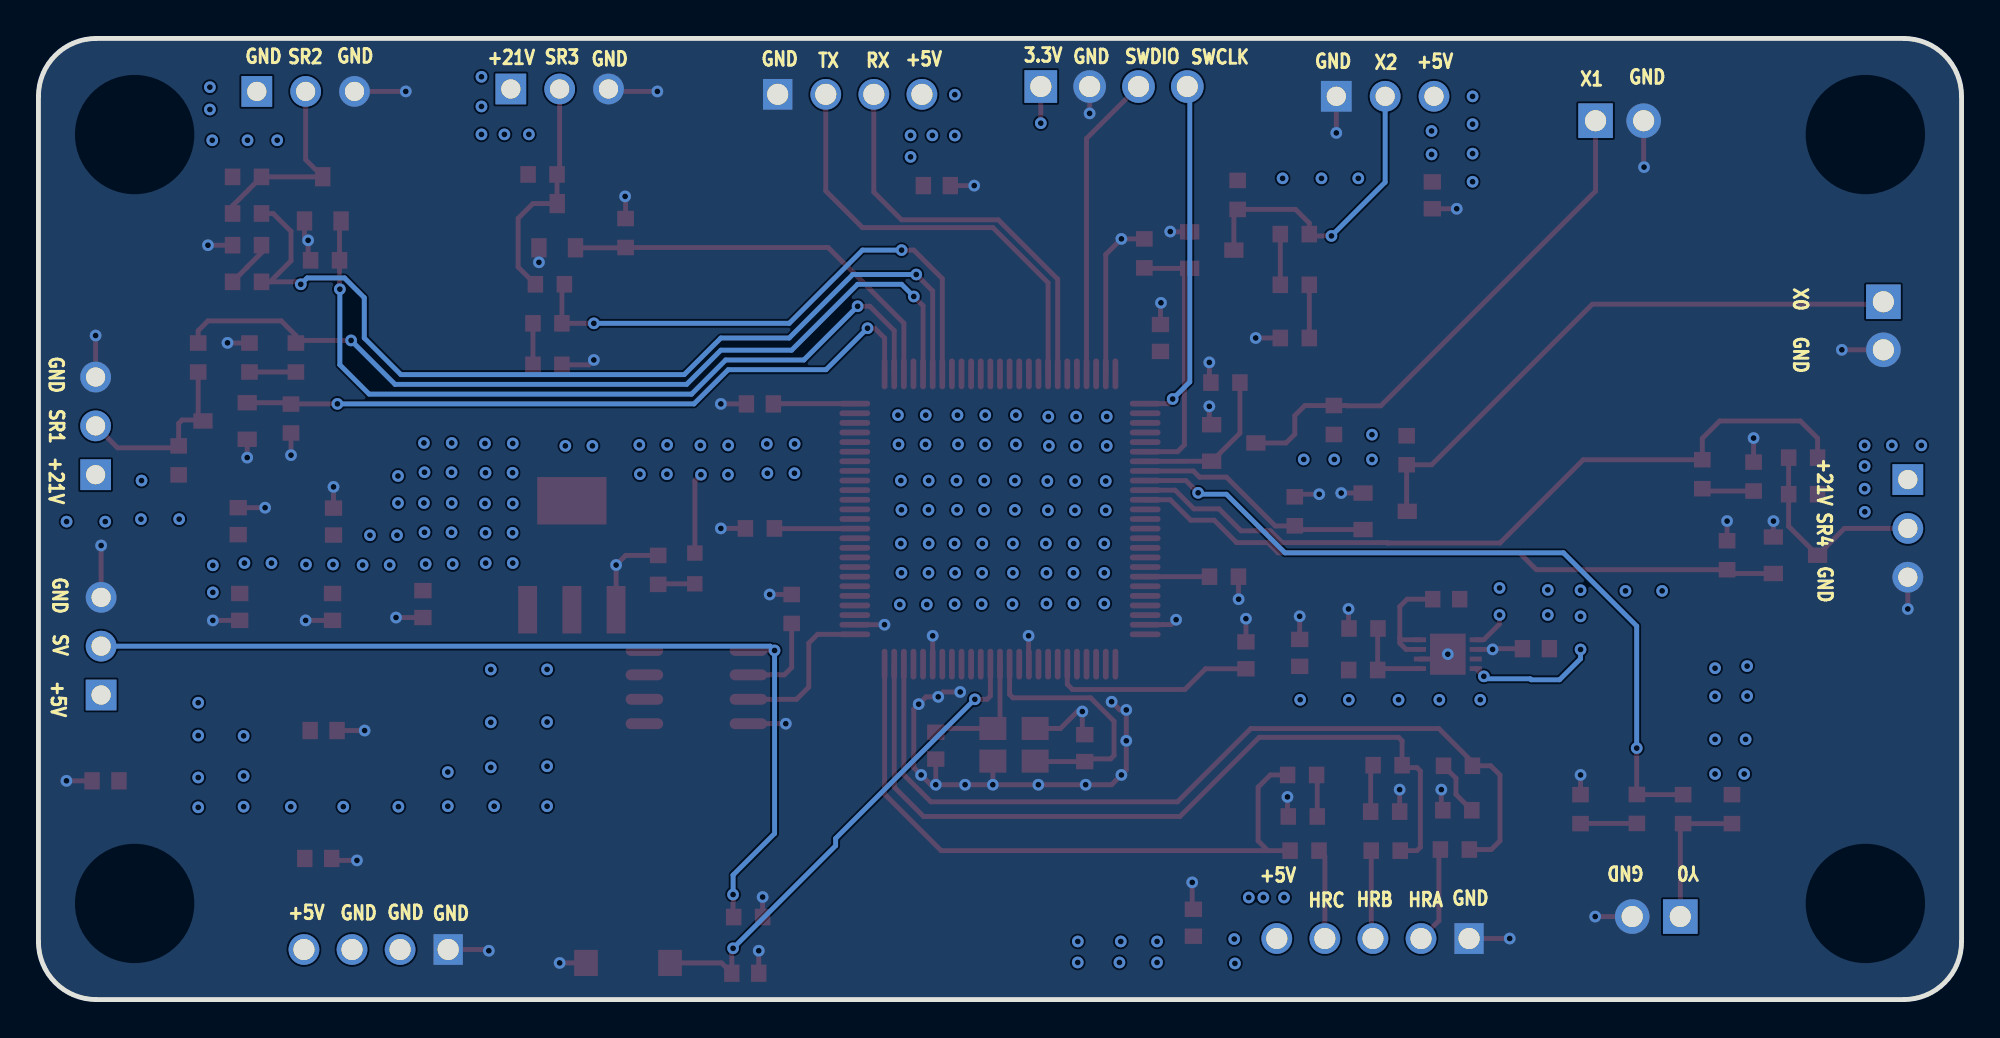
[diagram p5: board, bottom side, seen from below]

Outline 100 x 50 mm; copper layers: Top Layer, Inner1, Inner2, Bottom Layer. Coordinates in mm from the lower left corner of the outline.
Outline path: 0,47 0,3 arc(0.88,0.88) 3,0 97,0 arc(99.12,0.88) 100,3 100,47 arc(99.12,49.12) 97,50 3,50 arc(0.88,49.12) 0,47
Stack: Top Layer 0.035mm 外层铜厚1oz / Dielectric1 0.2104mm 7628 RC49% 8.6mil / Inner1 0.0152mm 内层铜厚 / Dielectric2 1.065mm 1.1mm H/HOZ Copper / Inner2 0.0152mm 内层铜厚 / Dielectric3 0.2104mm 7628 RC49% 8.6mil / Bottom Layer 0.035mm 外层铜厚1oz

## Design rules (mm)
template: 自定义配置
spacing copperThickness1oz (default): track to track 0.102, other pairs 0.152 to 0.3
spacing copperThickness2oz: track to track 0.203, other pairs 0.152 to 0.3
track width copperThickness1oz (default): min 0.127, default 0.254, max 2.54
track width copperThickness2oz: min 0.203, default 0.254, max 2.54
differential pair differentialPair (default): width min 0.127, default 0.254, max 2.54; gap min 0.152, default 0.152
via viaSize (default): diameter min 0.5, default 0.61, max 10; hole min 0.3, default 0.305, max 6.299

## Placement (name value [footprint] x y rotation side)
C1  100nF  [C0603]  85.17 14 180 top
C2  100nF  [C0603]  85.45 7.34 180 top
C3  100nF  [C0603]  62.48 30.99 0 top
C4  100nF  [C0603]  37.21 17.91 90 top
C5  100nF  [C0603]  63.25 1.37 0 top
C6  100nF  [C0603]  41.66 34.42 90 top
C7  100nF  [C0603]  89.61 24.89 270 top
C8  100nF  [C0603]  80.01 20.57 90 top
C9  100nF  [C0603]  84.66 24.87 270 top
C10  100nF  [C0603]  84.71 20.42 90 top
C11  100nF  [C0603]  89.53 20.42 90 top
C12  10pF  [C0603]  45.59 13.08 270 top
C13  10pF  [C0603]  53.34 13.21 90 top
C14  1uF  [C0603]  22.13 18.25 180 top
C16  2.2uF  [C0603]  34.42 18.03 270 top
C17  100nF  [C0603]  27.52 41.84 90 top
C18  100nF  [C0603]  96.51 11.38 0 top
C19  100nF  [C0603]  39.94 4 90 top
C20  100nF  [C0603]  53.28 42.34 0 top
CN1  ZX-XH2.54-4PZZ  [CONN-TH_4P-P2.50_4PIN]  82.44 2.6 0 top
CN2  ZX-XH2.54-3PZZ  [CONN-TH_3P-P2.54_2501S-3P]  29.97 46.99 180 top
CN3  ZX-XH2.54-3PZZ  [CONN-TH_3P-P2.54_2501S-3P]  96.74 18.38 90 top
CN4  ZX-XH2.54-2PZZ  [CONN-TH_2P-P2.50_HX25003-2A]  17.78 45.72 180 top
CN5  ZX-XH2.54-2PZZ  [CONN-TH_2P-P2.50_HX25003-2A]  4.06 35.05 270 top
CN6  ZX-XH2.54-2PZZ  [CONN-TH_2P-P2.50_HX25003-2A]  15.88 4.32 0 top
CN9  ZX-XH2.54-4PZZ  [CONN-TH_4P-P2.50_4PIN]  57.81 47.09 180 top
CN10  ZX-XH2.54-3PZZ  [CONN-TH_3P-P2.54_2501S-3P]  97.03 29.84 90 top
CN11  ZX-XH2.54-3PZZ  [CONN-TH_3P-P2.54_2501S-3P]  72.9 47.37 180 top
CN12  ZX-XH2.54-3PZZ  [CONN-TH_3P-P2.54_2501S-3P]  86.11 47.24 180 top
CN13  ZX-XH2.54-3PZZ  [CONN-TH_3P-P2.54_2501S-3P]  2.79 24.51 270 top
H1  PZ254V-11-04P  [HDR-TH_4P-P2.54-V-M]  44.07 47.5 180 top
L1  22uH  [L0603]  26.8 20.83 0 top
LED1  -  [LED_0603]  65.86 22.48 90 top
Q1  AO3400  [SOT-23_L2.9-W1.3-P1.90-LS2.4-BR]  37.85 28.96 0 top
Q2  AO3400  [SOT-23_L2.9-W1.3-P1.90-LS2.4-BR]  29.97 25.4 0 top
Q3  AO3400  [SOT-23_L2.9-W1.3-P1.90-LS2.4-BR]  38.99 38.99 0 top
Q4  AO3400  [SOT-23_L2.9-W1.3-P1.90-LS2.4-BR]  90.3 30.1 180 top
Q5  AO3400  [SOT-23_L2.9-W1.3-P1.90-LS2.4-BR]  85.22 41.66 270 top
Q6  AO3400  [SOT-23_L2.9-W1.3-P1.90-LS2.4-BR]  73.03 40.26 270 top
Q7  AO3400  [SOT-23_L2.9-W1.3-P1.90-LS2.4-BR]  8.64 23.11 0 top
R1  10K  [R0603]  38.35 22 0 top
R2  10K  [R0603]  62.48 24.51 180 top
R3  5.1K  [R0603]  63.1 4.29 0 top
R4  10K  [R0603]  60.83 20.32 270 top
R9  10K  [R0603]  34.67 39.82 0 top
R10  10K  [R0603]  34.67 37.19 180 top
R11  10K  [R0603]  34.67 34.42 0 top
R12  10K  [R0603]  26.35 7.81 180 top
R13  10K  [R0603]  26.19 12.16 0 top
R14  10K  [R0603]  26.22 9.85 0 top
R15  10K  [R0603]  29.94 7.75 180 top
R16  10K  [R0603]  29.84 12.19 0 top
R17  10K  [R0603]  29.97 9.78 180 top
R18  10K  [R0603]  34.16 7.75 0 top
R19  10K  [R0603]  34.29 11.68 180 top
R20  10K  [R0603]  34.26 9.53 0 top
R21  510R  [R0603]  67.78 22.35 270 top
R22  10K  [R0603]  31.1 19.3 180 top
R23  510K  [R0603]  31.12 17.14 0 top
R26  10K  [R0603]  32.64 30.15 270 top
R27  10k  [R0603]  38.28 32.1 180 top
R29  10K  [R0603]  28.85 28.58 90 top
R30  10k  [R0603]  34.67 25.4 270 top
R32  10K  [R0603]  37.64 41.86 90 top
R33  10k  [R0603]  42.49 38.82 270 top
R35  10K  [R0603]  14.48 9.91 90 top
R36  10K  [R0603]  16.88 9.91 270 top
R37  10K  [R0603]  19.81 9.91 90 top
R38  4.7K  [R0603]  11.94 9.91 90 top
R39  10K  [R0603]  91.69 33.4 90 top
R40  10K  [R0603]  86.61 33.4 270 top
R41  10K  [R0603]  89.03 33.4 90 top
R42  10K  [R0603]  89.15 40.89 180 top
R43  10K  [R0603]  89.15 37.34 0 top
R44  10K  [R0603]  89.15 39.24 0 top
R45  10K  [R0603]  73.41 37.21 180 top
R46  10K  [R0603]  73.53 35.18 0 top
R47  10K  [R0603]  73.53 33.02 180 top
R48  10K  [R0603]  8.24 28.19 180 top
R49  10K  [R0603]  13.48 27.33 270 top
R50  10K  [R0603]  10.81 27.21 90 top
R51  10K  [R0603]  92.71 28.05 270 top
R52  10k  [R0603]  86.87 30.23 90 top
R53  10K  [R0603]  89.15 42.8 0 top
R54  10k  [R0603]  85.1 38.45 180 top
R55  10K  [R0603]  73.79 42.93 0 top
R56  10k  [R0603]  69.47 39.88 270 top
R57  10K  [R0603]  8.24 26.29 180 top
R58  10k  [R0603]  12.19 23.11 270 top
SW1  TS-1088-AR02016  [SW-SMD_L3.9-W3.0-P4.45]  69.34 1.91 180 top
U1  STM32F407VET6  [LQFP-100_L14.0-W14.0-P0.50-LS16.0-BL]  50 25 0 top
U2  AMS1117-3.3V  [SOT-223-4_L6.5-W3.5-P2.30-LS7.0-TR]  72.26 23.11 0 top
U3  LM358DT  [SOIC-8_L5.0-W4.0-P1.27-LS6.0-BL]  65.79 16.26 270 top
U6  XL6109  [DFN-8_L3.0-W3.0-P0.50-TL-EP2.1]  26.71 17.97 0 top
U7  ZX-XH2.54-5PZZ  [CONN-TH_5P-P2.50_ZX-XH2.54-5PZZ]  30.61 3.17 0 top
X1  25MHz  [CRYSTAL-SMD_4P-L3.2-W2.5-BL]  49.27 13.25 180 top

## Footprints (pads in the part's own frame, mm; a bottom-side part is the same pattern mirrored in y, then rotated)
C0603
  rect 0.8x0.9 smd: 1(-0.7,0) 2(0.7,0)
CONN-TH_2P-P2.50_HX25003-2A
  rect 1.8x1.8 hole 1.1: 1(-1.25,0)
  round 1.8 hole 1.1: 2(1.25,0)
CONN-TH_3P-P2.54_2501S-3P
  rect 1.6x1.6 hole 1: 1(-2.54,0)
  round 1.6 hole 1: 2(0,0) 3(2.54,0)
CONN-TH_4P-P2.50_4PIN
  rect 1.524x1.6 hole 1.1: 1(-3.75,0)
  round 1.6 hole 1.1: 2(-1.25,0) 3(1.25,0) 4(3.75,0)
CONN-TH_5P-P2.50_ZX-XH2.54-5PZZ
  rect 1.524x1.6 hole 1.1: 1(-5,0)
  round 1.6 hole 1.1: 2(-2.5,0) 3(0,0) 4(2.5,0) 5(5,0)
CRYSTAL-SMD_4P-L3.2-W2.5-BL
  rect 1.4x1.2 smd: 1(-1.1,-0.85) 2(1.1,-0.85) 3(1.1,0.85) 4(-1.1,0.85)
DFN-8_L3.0-W3.0-P0.50-TL-EP2.1
  rect 0.63x0.25 smd: 1(-1.45,0.75) 2(-1.45,0.25) 3(-1.45,-0.25) 4(-1.45,-0.75) 5(1.45,-0.75) 6(1.45,-0.25) 7(1.45,0.25) 8(1.45,0.75)
  rect 1.85x2.14 smd: 9(0,0)
HDR-TH_4P-P2.54-V-M
  rect 1.7x1.7 hole 1.1: 1(-3.81,0)
  round 1.7 hole 1.1: 2(-1.27,0) 3(1.27,0) 4(3.81,0)
L0603
  rect 0.8x0.864 smd: 1(-0.7,0) 2(0.7,0)
LED_0603
  rect 0.8x0.8 smd: 1(-0.851,-0.01) 2(0.75,-0.005)
LQFP-100_L14.0-W14.0-P0.50-LS16.0-BL
  oval 0.3x1.6 smd: 1(-6,-7.55) 2(-5.5,-7.55) 3(-5,-7.55) 4(-4.5,-7.55) 5(-4,-7.55) 6(-3.5,-7.55) 7(-3,-7.55) 8(-2.5,-7.55) 9(-2,-7.55) 10(-1.5,-7.55) 11(-1,-7.55) 12(-0.5,-7.55) 13(0,-7.55) 14(0.5,-7.55) 15(1,-7.55) 16(1.5,-7.55) 17(2,-7.55) 18(2.5,-7.55) 19(3,-7.55) 20(3.5,-7.55) 21(4,-7.55) 22(4.5,-7.55) 23(5,-7.55) 24(5.5,-7.55) 25(6,-7.55) 51(6,7.55) 52(5.5,7.55) 53(5,7.55) 54(4.5,7.55) 55(4,7.55) 56(3.5,7.55) 57(3,7.55) 58(2.5,7.55) 59(2,7.55) 60(1.5,7.55) 61(1,7.55) 62(0.5,7.55) 63(0,7.55) 64(-0.5,7.55) 65(-1,7.55) 66(-1.5,7.55) 67(-2,7.55) 68(-2.5,7.55) 69(-3,7.55) 70(-3.5,7.55) 71(-4,7.55) 72(-4.5,7.55) 73(-5,7.55) 74(-5.5,7.55) 75(-6,7.55)
  oval 1.6x0.3 smd: 26(7.55,-6) 27(7.55,-5.5) 28(7.55,-5) 29(7.55,-4.5) 30(7.55,-4) 31(7.55,-3.5) 32(7.55,-3) 33(7.55,-2.5) 34(7.55,-2) 35(7.55,-1.5) 36(7.55,-1) 37(7.55,-0.5) 38(7.55,0) 39(7.55,0.5) 40(7.55,1) 41(7.55,1.5) 42(7.55,2) 43(7.55,2.5) 44(7.55,3) 45(7.55,3.5) 46(7.55,4) 47(7.55,4.5) 48(7.55,5) 49(7.55,5.5) 50(7.55,6) 76(-7.55,6) 77(-7.55,5.5) 78(-7.55,5) 79(-7.55,4.5) 80(-7.55,4) 81(-7.55,3.5) 82(-7.55,3) 83(-7.55,2.5) 84(-7.55,2) 85(-7.55,1.5) 86(-7.55,1) 87(-7.55,0.5) 88(-7.55,0) 89(-7.55,-0.5) 90(-7.55,-1) 91(-7.55,-1.5) 92(-7.55,-2) 93(-7.55,-2.5) 94(-7.55,-3) 95(-7.55,-3.5) 96(-7.55,-4) 97(-7.55,-4.5) 98(-7.55,-5) 99(-7.55,-5.5) 100(-7.55,-6)
R0603
  rect 0.806x0.864 smd: 1(-0.753,0) 2(0.753,0)
SOIC-8_L5.0-W4.0-P1.27-LS6.0-BL
  oval 0.569x1.95 smd: 1(-1.905,-2.705) 2(-0.635,-2.705) 3(0.635,-2.705) 4(1.905,-2.705) 5(1.905,2.705) 6(0.635,2.705) 7(-0.635,2.705) 8(-1.905,2.705)
SOT-23_L2.9-W1.3-P1.90-LS2.4-BR
  rect 1x0.8 smd: 1(1.15,-0.95) 2(1.15,0.95) 3(-1.15,0)
SOT-223-4_L6.5-W3.5-P2.30-LS7.0-TR
  rect 0.98x2.47 smd: 1(-2.3,-2.835) 2(0,-2.835) 3(2.3,-2.835)
  rect 3.6x2.47 smd: 4(0,2.835)
SW-SMD_L3.9-W3.0-P4.45
  rect 1.23x1.36 smd: 1(-2.185,0) 2(2.185,0)

## Nets
As in the schematic.

Pads without a net: CN1 2 3; U1 1 2 3 4 5 7 8 9 15 16 17 18 29 30 31 32 33 34 35 36 38 39 40 41 42 43 44 45 46 47 48 49 54 58 59 60 61 62 63 64 65 66 67 70 71 73 77 78 79 80 87 88 89 90 91 92 93 95 96 97 98; U3 5 6 7

## Via types
v1: diameter 0.61, hole 0.305, Top Layer to Bottom Layer, 292 vias

## Routing (per net, layer and track width the routed paths; a pad name or vN(x,y) marks a point on that pad's centre or on a via; arc(x,y) is an arc through that point)
+5V: length 8.6
  Top Layer w0.254: 25.26,18.72 24.84,18.72 24.02,19.54 v1(24.02,20.01) ; 25.26,17.22 25.24,17.22 v1(24.84,16.81)
  Bottom Layer w0.254: v1(19.81,18.21) 19.81,17.73 20.9,16.64 22.38,16.64 22.43,16.69 24.71,16.69 24.79,16.76
  vias: v1(11.15,17.35) v1(11.15,15.79) v1(11.23,13.54) v1(11.3,11.73) v1(12.82,17.24) v1(12.82,15.77) v1(12.82,13.54) v1(12.82,11.73) v1(15.57,21.26) v1(17.47,21.26) v1(19.81,21.3) v1(19.81,19.93) v1(21.51,21.31) v1(21.51,20.01) v1(24.02,21.41) v1(25.43,46.99) v1(25.43,45.54) v1(25.43,44.01) v1(25.43,42.55) v1(27.56,45.19) v1(27.56,43.97) v1(30.66,29.39) v1(30.66,28.1) v1(31.37,42.72) v1(32.62,28.1) v1(33.28,42.72) v1(34.21,28.1) v1(35.23,5.31) v1(35.31,42.72) v1(36.31,5.31) v1(37.06,5.31) v1(37.82,3.15) v1(37.78,1.88) v1(41.83,3.02) v1(41.83,1.93) v1(43.72,3.02) v1(43.79,1.93) v1(45.95,3.02) v1(45.96,1.93) v1(52.35,47.07) v1(52.35,44.95) v1(53.52,44.96) v1(54.65,44.96) v1(54.65,43.84) v1(73.55,17.18) v1(73.55,14.44) v1(73.55,12.14) v1(73.55,10.06) v1(76.31,10.06) v1(76.48,17.17) v1(76.48,14.42) v1(76.48,12.08) v1(78.71,11.84) v1(78.71,10.06) v1(81.28,10.03) v1(84.15,10.03) v1(86.88,10.03) v1(89.33,13.72) v1(89.33,11.63) v1(89.33,10.03) v1(91.69,15.44) v1(91.69,13.73) v1(91.69,11.55) v1(91.69,10)
GND: length 132
  Top Layer w0.254: v1(35.05,10.54) 35.05,9.57 R20.2 ; R58.1 v1(12.19,24.89) ; R21.1 69.46,23.11 v1(69.96,22.61) U2.1 ; C6.2 41.66,36.22 v1(41.63,36.25) ; C16.1 v1(34.42,19.94) ; v1(39.12,30.86) 39.12,30.03 Q1.2 ; C9.1 v1(84.66,26.67) ; R52.1 v1(86.87,28.32) ; U1.20 v1(53.5,18.92) ; CN3.3 v1(96.74,23.62) ; v1(76.58,2.54) 76.64,2.6 CN1.1 ; R50.2 v1(10.81,29.21) ; U7.1 v1(23.5,3.17) ; R14.2 27.05,9.93 v1(27.05,10.92) ; v1(26.71,17.97) 26.96,17.72 28.16,17.72 ; v1(50.37,11.18) v1(48.01,11.18) v1(45.55,11.18) 44.2,11.18 v1(43.69,11.68) 43.43,11.94 v1(43.43,13.46) v1(43.43,15.07) 43.77,15.07 v1(44.2,15.49) ; v1(50.37,11.18) X1.4 ; v1(50.37,11.18) v1(51.82,11.18) v1(53.34,11.18) ; C20.1 v1(51.34,42.34) ; R27.1 39.12,32.18 v1(39.12,33.15) ; v1(69.49,41.78) 69.47,41.76 R56.1 ; C5.1 v1(62.55,2.54) ; C12.1 45.72,13.91 v1(45.72,14.99) 45.97,14.99 46.86,14.1 X1.2 ; C18.2 v1(98.54,11.38) ; Q3.2 41.13,39.94 v1(41.15,39.95) ; CN10.3 v1(97.03,34.54) ; 2.79,21.97 v1(2.79,20.32) ; v1(40.84,19.76) 41.1,19.51 41.55,19.51 41.56,19.5 U1.99 ; v1(90.17,34.16) 90.16,34.15 R41.2 ; R37.2 v1(19.81,11.68) ; H1.2 v1(45.34,46.1) ; C10.1 v1(86.11,19.72) ; R44.2 v1(91.19,39.24) ; CN6.2 v1(19.05,4.32) ; v1(40,6.1) 40,4.76 C19.2 ; Q5.2 86.17,39.69 v1(85.98,39.5) 85.98,38.58 R54.1 ; U3.4 v1(61.14,14.35) ; R3.1 v1(62.34,5.33) ; C11.1 v1(90.93,19.72) ; v1(9.78,24.89) 9.79,24.89 Q7.2 ; R22.1 31.88,19.33 v1(31.88,20.32) ; C13.1 v1(53.34,11.18) ; v1(53.34,11.18) 53.59,11.18 v1(54.1,11.68) 54.48,12.06 54.48,15.11 v1(54.23,15.37) 53.85,15.75 v1(53.21,15.75) 52.96,16 v1(52.07,16) ; Q6.2 v1(73.97,38.35) ; CN4.2 16.53,43.33 v1(16.51,43.31) ; C4.2 v1(37.21,19.81) ; 25.26,18.22 v1(24.38,18.22) 24.35,18.25 C14.1 ; Q2.2 v1(32.26,26.35) ; C1.2 v1(83.04,14) ; R2.1 v1(64.52,24.51) ; v1(83.44,7.24) 84.65,7.24 C2.2 ; R17.2 v1(29.22,10.92) ; v1(48.51,18.92) 48.51,17.46 U1.10 ; R11.2 v1(36.7,34.42) ; v1(33.4,26.29) 34.54,26.29 R30.1 ; R1.1 37.6,20.84 v1(37.59,20.83) ; SW1.1 v1(72.9,1.91) ; R4.1 v1(61.98,21.07) ; U1.27 v1(56.01,19.5) ; R47.2 71.37,33.02 v1(71.12,33.27) ; C8.1 v1(81.41,19.87) ; CN12.3 v1(80.9,47.24) ; C17.1 v1(26.25,41.14) ; CN5.2 v1(6.22,33.8) ; CN11.3 70.23,47.24 v1(67.82,47.24) ; CN2.1 v1(32.51,45.08) ; U1.74 44.5,38.76 v1(43.69,39.57) R33.1 ; Q4.2 v1(89.15,28.19) ; C3.2 v1(64.52,30.99) ; C7.1 v1(88.22,25.59)
VCC_3.3V: length 10.4
  Top Layer w0.254: LED1.2 65.87,26.99 v1(65.55,27.31) ; U1.50 61.77,31 C3.1 ; H1.1 v1(47.88,45.59)
  vias: v1(44.45,30.33) v1(44.45,28.8) v1(44.5,26.97) v1(44.5,25.45) v1(44.58,23.72) v1(44.58,22.2) v1(44.58,20.6) v1(46.04,30.33) v1(46.05,28.8) v1(46.09,26.97) v1(46.1,25.45) v1(46.17,23.72) v1(46.18,22.2) v1(46.18,20.6) v1(47.49,30.33) v1(47.46,28.8) v1(47.54,26.97) v1(47.51,25.45) v1(47.62,23.72) v1(47.59,22.2) v1(47.59,20.6) v1(49.17,30.4) v1(49.17,28.88) v1(49.22,27) v1(49.22,25.48) v1(49.33,23.72) v1(49.33,22.2) v1(49.35,20.57) v1(50.77,30.4) v1(50.78,28.88) v1(50.82,27) v1(50.83,25.48) v1(50.92,23.72) v1(50.93,22.2) v1(50.96,20.57) v1(52.21,30.4) v1(52.18,28.88) v1(52.23,25.48) v1(52.26,27) v1(52.34,22.2) v1(52.36,23.72) v1(52.36,20.57) v1(53.71,27) v1(53.72,25.48) v1(53.71,23.72) v1(53.72,22.2) v1(53.81,20.55) v1(53.86,30.4) v1(53.87,28.88) v1(55.13,25.48) v1(55.13,22.2) v1(55.16,27) v1(55.16,23.72) v1(55.21,20.55) v1(55.31,30.4) v1(55.28,28.88) v1(60.68,28.91) v1(60.69,27.38) v1(62.13,28.91) v1(62.1,27.38) v1(64.13,28.83) v1(64.15,27.31) v1(65.58,28.83) v1(67.31,28.85) v1(67.32,27.33) v1(68.73,27.33) v1(68.75,28.85) v1(71.2,28.8) v1(72.6,28.8) v1(75.34,28.93) v1(75.35,27.41) v1(75.34,25.81) v1(75.35,24.28) v1(75.34,22.71) v1(76.74,22.71) v1(76.78,28.93) v1(76.75,27.41) v1(76.78,25.81) v1(76.75,24.28) v1(78.51,28.96) v1(78.52,27.43) v1(78.51,25.83) v1(78.52,24.31) v1(78.46,22.66) v1(79.93,27.43) v1(79.93,24.31) v1(79.87,22.66) v1(79.96,28.96) v1(79.96,25.83) v1(81.31,27.24) v1(81.31,25.83) v1(81.36,24.16) v1(81.74,22.61) v1(82.76,24.16) v1(83.14,22.61) v1(84.68,22.63) v1(86.09,22.63) v1(87.88,22.71) v1(89.29,22.71) v1(90.93,22.59) v1(90.93,21.18)
VCC_21V:
  vias: v1(2.09,28.83) v1(3.62,28.83) v1(5.04,28.83) v1(5.04,27.76) v1(5.04,26.58) v1(5.03,25.37) v1(25.03,15.6) v1(27.16,15.6) v1(29.27,15.6) v1(31.86,15.6) v1(34.39,15.6) v1(74.5,45.01) v1(75.77,45.01) v1(76.96,48) v1(76.96,46.46) v1(76.96,45.01) v1(87.59,44.7) v1(89.13,44.7) v1(90.96,44.7) v1(91.09,47.47) v1(91.09,46.3) v1(92.68,24.99) v1(94.64,27) v1(94.67,24.99) v1(96.53,24.86) v1(98.54,24.86)
BOOT0: length 3.3
  Top Layer w0.254: R1.2 U1.94
BOOT1: length 4.2
  Top Layer w0.254: U1.37 61.72,24.5 R2.2
HR_SU_SIGNAL_A: length 45.2
  Top Layer w0.254: R12.2 24.45,7.81 24,8.25 24,11.68 24.48,12.16 R13.1 25.43,12.35 27.18,14.1 36.96,14.1 40.77,10.29 53.59,10.29 55,11.69 U1.23
HR_SU_SIGNAL_B: length 42.6
  Top Layer w0.254: R15.2 28.32,7.75 28.14,7.93 28.14,11.89 28.32,12.06 28.96,12.06 R16.1 29.09,13.46 29.27,13.64 36.52,13.64 40.64,9.53 53.97,9.53 55.5,11.05 U1.24
HR_SU_SIGNAL_C: length 34.4
  Top Layer w0.254: U1.25 56,10.69 53.06,7.75 36.07,7.75 ; 36.07,7.75 R18.2 ; 36.07,7.75 36.58,8.25 36.58,11.05 35.94,11.68 R19.1
HRA: length 5
  Top Layer w0.254: U7.2 27.18,4.1 27.18,7.73 R12.1
HRB: length 4.6
  Top Layer w0.254: R15.1 30.7,3.26 U7.3
HRC: length 4.7
  Top Layer w0.254: R18.1 33.11,7.44 U7.4
NRST: length 25.5
  Top Layer w0.254: U1.14 50.5,15.79 50.67,15.62 v1(51.31,15.62) ; SW1.2 64.48,1.91 C5.2 63.95,2.6 v1(63.88,2.67)
  Bottom Layer w0.254: v1(63.88,2.67) 58.55,8 58.55,8.38 v1(51.31,15.62)
OSC_IN: length 13.6
  Top Layer w0.254: X1.3 48.15,12.38 C12.2 45.45,12.52 44.25,12.52 44.07,12.7 44.07,14.48 45.29,15.7 49.32,15.7 49.5,15.88 U1.12
OSC_OUT: length 6.5
  Top Layer w0.254: U1.13 50,14.47 X1.1 53.15,14.1 C13.2
SENSOR1: length 46.4
  Top Layer w0.254: v1(54.48,36.58) 54,36.09 U1.55 ; v1(83.74,34.29) 86.48,34.29 R40.1 86.61,34.54 87.38,35.31 91.19,35.31 91.69,34.8 R39.2
  Bottom Layer w0.254: v1(54.48,36.58) 55.12,37.21 57.4,37.21 60.83,33.78 64.52,33.78 66.29,32 81.46,32 v1(83.74,34.29)
SENSOR1_SW: length 36.9
  Top Layer w0.254: Q4.1 86.94,31.05 R52.2 86.86,30.99 v1(84.46,30.99) ; U1.51 56,34.41 56.51,34.92 v1(56.89,34.92)
  Bottom Layer w0.254: v1(84.46,30.99) 65.91,30.99 64.13,32.77 59.05,32.77 v1(56.89,34.92)
SENSOR2: length 50.2
  Top Layer w0.254: 87.96,37.34 86.49,37.34 v1(86.36,37.21) ; 87.96,37.34 R43.1 ; 87.96,37.34 86.87,38.43 86.87,39.97 87.8,40.89 R42.2 ; U1.56 53.5,36.86 v1(54.36,37.72)
  Bottom Layer w0.254: v1(86.36,37.21) 86.03,37.54 84.09,37.54 83.06,36.51 83.06,34.42 81.15,32.51 66.42,32.51 64.52,34.42 60.96,34.42 57.66,37.72 v1(54.36,37.72)
SENSOR2_SW: length 41.7
  Top Layer w0.254: v1(84.33,36.96) 84.35,36.97 84.35,40.43 Q5.1 ; U1.52 55.5,34.8 56.77,36.07 v1(57.4,36.07)
  Bottom Layer w0.254: v1(84.33,36.96) 84.33,33.02 82.8,31.5 66.04,31.5 64.26,33.27 60.2,33.27 v1(57.4,36.07)
SENSOR3: length 29
  Top Layer w0.254: v1(71.12,35.18) R46.1 72.78,37.08 R45.2 ; U1.57 53,37.51 54.48,38.99 v1(55.12,38.99)
  Bottom Layer w0.254: v1(55.12,38.99) 57.15,38.99 60.96,35.18 v1(71.12,35.18)
SENSOR3_SW: length 21.3
  Top Layer w0.254: U1.53 55,35.19 58.94,39.12 R56.2 69.48,39.11 Q6.1
SENSOR4: length 40.8
  Top Layer w0.254: U1.85 40.89,26.5 39.92,25.53 38.61,25.53 37.47,24.38 35.94,24.38 35.32,23.77 29.87,23.77 29.84,23.75 24,23.75 19.67,28.08 R49.1 13.48,29.19 12.57,30.1 8.38,30.1 7.48,29.2 R48.2
SENSOR4_SW: length 34.3
  Top Layer w0.254: U1.86 41.15,26 40.09,24.94 38.86,24.94 37.7,23.77 36.07,23.77 35.54,23.24 22.99,23.24 22.11,22.36 R58.2 12,22.16 Q7.1
SENSOR_MOTOR1: length 9.9
  Top Layer w0.254: 91.5,30.15 Q4.3 ; 91.5,30.15 91.69,30.35 R39.1 ; 91.5,30.15 92.53,30.15 92.71,29.97 R51.1 92.81,28.7 95.88,28.7 CN10.2
SENSOR_MOTOR2: length 10.5
  Top Layer w0.254: R42.1 89.91,41.29 R53.1 85.22,42.8 Q5.3 86.11,43.69 CN12.2
SENSOR_MOTOR3: length 12.2
  Top Layer w0.254: CN11.2 72.9,43.06 R55.1 73.03,41.42 Q6.3 74.29,41.41 75.06,40.64 75.06,38.11 R45.1
SENSOR_MOTOR4: length 11
  Top Layer w0.254: CN13.2 6.09,24.51 Q7.3 8.99,24.62 R57.1 R48.1
SV: length 51.2
  Top Layer w0.254: U3.1 v1(61.72,18.16) ; R3.2 63.88,4.32 v1(63.88,5.46)
  Bottom Layer w0.254: CN3.2 61.94,18.38 v1(61.72,18.16) 61.72,8.64 63.88,6.48 v1(63.88,5.46)
SV_DACOUT: length 8.3
  Top Layer w0.254: U1.26 59.49,19 59.94,18.54 59.94,16.26 60.58,15.62 U3.3
SWCLK: length 18.2
  Top Layer w0.254: v1(41.02,31.24) 41.26,31 U1.76
  Bottom Layer w0.254: H1.4 40.13,47.37 40.13,32.13 v1(41.02,31.24)
SWDIO: length 16.1
  Top Layer w0.254: 42.8,47.5 45.5,44.8 U1.72
USART_RX: length 21.4
  Top Layer w0.254: U1.69 47,37.47 50.09,40.56 55.12,40.56 56.56,42.01 CN9.3
USART_TX: length 23.3
  Top Layer w0.254: CN9.2 59.06,42.07 57.15,40.16 50.37,40.16 47.5,37.29 U1.68
X0: length 30.7
  Top Layer w0.254: Q2.3 28.85,25.43 R29.1 27.55,27.82 19.2,36.17 4.19,36.17 CN5.1
X0_START_STOP: length 12.6
  Top Layer w0.254: U1.83 39.95,27.5 39.62,27.18 38.23,27.18 35.69,24.64 34.68,24.64 R30.2 34.47,24.45 Q2.1
X1: length 27.3
  Top Layer w0.254: CN4.1 19.03,42.06 30.2,30.89 31.96,30.89 31.97,30.9 R26.1 34.15,30.9 34.67,30.38 34.67,29.41 35.13,28.96 Q1.3
X1_MOT_DIR: length 8.2
  Top Layer w0.254: R27.2 37.52,29.46 38.98,28.01 Q1.1 U1.82
X2: length 16.4
  Top Layer w0.254: Q3.3 37.84,40.91 R32.1 34.63,41.11 33.92,40.39 R9.1 33.82,39.73 v1(32.77,39.73)
  Bottom Layer w0.254: CN2.2 29.97,42.52 v1(32.77,39.73)
X2_SIGNAL_INPUT: length 2.6
  Top Layer w0.254: R10.1 R9.2
X2_SIGNAL_TO_MOTOR: length 13.8
  Top Layer w0.254: R33.2 42.47,38.04 Q3.1 40.41,37.77 40.41,28.86 40.77,28.5 U1.81
Y0: length 7.4
  Top Layer w0.254: CN6.1 14.62,9.01 R35.1 R38.1
Y0_ALARM: length 39.9
  Top Layer w0.254: v1(39.7,26.36) 40.34,27 U1.84 ; R35.2 16.87,10.66 R36.1 16.89,10.68 v1(16.89,13.08)
  Bottom Layer w0.254: v1(16.89,13.08) 16.89,19.43 20.7,23.24 35.18,23.24 38.23,26.29 39.62,26.29 v1(39.7,26.36)
$1N1908: length 10.9
  Top Layer w0.254: U1.6 46.5,16.4 46.23,16.13 40.39,16.13 39.31,17.21 C4.1
$1N4124: length 1.9
  Top Layer w0.254: R21.2 67.75,21.63 LED1.1
$2N1061: length 4.7
  Top Layer w0.254: R4.2 60.83,17.27 61.21,16.89 U3.2
$2N1709: length 2.8
  Top Layer w0.254: R11.1 R10.2
$2N1843: length 2.9
  Top Layer w0.254: R14.1 26.29,10.67 26.29,11.51 26.94,12.16
$2N1940: length 2.5
  Top Layer w0.254: R16.2 30.73,12.06 R17.1
$2N2037: length 2.2
  Top Layer w0.254: R20.1 33.5,11.65 R19.2
$2N3321: length 4.4
  Top Layer w0.254: R22.2 30.36,19.29 R23.1 30.29,17.22 28.16,17.22
$2N3441: length 6
  Top Layer w0.254: L1.2 28.83,20.83 29.21,20.45 29.21,18.81 ; 29.21,18.81 29.12,18.72 28.16,18.72 ; 29.21,18.81 29.21,18.54 28.88,18.22 28.16,18.22
$2N4181: length 2.9
  Top Layer w0.254: 16.88,9.16 19.8,9.16 R37.1
$4N232: length 2.4
  Top Layer w0.254: R41.1 R40.2
$4N1207: length 2.5
  Top Layer w0.254: R44.1 88.4,38.85 89.15,38.1 89.15,38.09 R43.2
$4N1320: length 2.2
  Top Layer w0.254: R46.2 R47.1
$4N1433: length 2.7
  Top Layer w0.254: R50.1 13.36,26.45 R49.2

## Copper pours and planes (outline as drawn; the poured copper is in the pictures)
+5V on Top Layer: 38.94,44.09 39.34,43.69 39.34,42.04 39.19,41.88 24.92,41.88 24.23,42.57 24.23,47.7 25.35,48.82 28.19,48.82 28.85,48.16 28.85,44.68 29.44,44.09
+5V on Top Layer: 26.26,22.05 26.29,22.07 26.77,21.59 26.77,20.02 26.64,19.89 26.26,19.89 25.68,19.3 25.68,18.54 25.6,18.47 24.84,18.47 24.05,19.25 22.34,19.25 22.13,19.04 22.13,17.81 21.44,17.12 18.59,17.12 18.57,17.09 14.22,17.09 13.31,16.18 13.31,10.44 12.78,9.91 11.02,9.91 10.62,10.31 10.62,18.59 14.07,22.05
+5V on Top Layer: 34.29,4.72 34.29,2.16 34.95,1.5 47.14,1.5 48.18,2.54 48.18,3.28 47.4,4.06 38.68,4.06 37.04,5.7 35.27,5.7
+5V on Top Layer: 27.97,28.58 27.36,29.13 27.31,29.13 27.31,30.17 27.53,30.4 31.72,30.4 31.98,30.15 33.83,30.15 34.06,29.92 34.06,29.34 34.82,28.58 34.82,27.76 34.21,27.15 30.48,27.15 30.05,27.58 30.05,28.17 29.64,28.58
+5V on Top Layer: 89.53,16.64 90.09,17.2 97.18,17.2 97.21,17.22 97.97,16.46 97.99,16.46 97.99,14.07 96.52,12.6 96.52,9.58 95.3,8.36 92.15,8.36 90.2,6.4 86.66,6.4 86.44,6.63 85.76,6.63 85.76,7.89 84.99,8.66 81.94,8.66 81.91,8.69 72.85,8.69 70.46,11.07 70.46,17.09 70.26,17.3 70.26,17.32 67.44,17.32 67.11,17.65 67.11,18.21 67.69,18.8 73.08,18.8 73.33,19.05 73.33,21.26 73.89,21.82 75.62,21.82 76.05,21.39 76.05,19.02 77.67,17.4 77.67,14.4 78.79,13.28 79.53,13.28 80.39,12.42 84.43,12.42 85.17,13.17 85.17,14.76 85.67,15.27 88.95,15.27 89.53,15.86
+5V on Top Layer: 53.28,42.97 53.28,41.46 53.77,40.97 54.81,40.97 55.42,41.58 55.42,48.29 54.97,48.74 51.83,48.74 51.59,48.5 51.59,44.2 51.99,43.79 52.88,43.79 53.26,43.41 53.26,42.95
+5V on Inner2: 97.21,17.2 97.92,16.48 97.97,16.48 97.97,13.89 96.7,12.62 96.57,12.62 96.57,9.58 95.35,8.36 92.2,8.36 90.22,6.38 85.81,6.38 85.45,6.74 85.45,8.15 85.12,8.48 41.33,8.48 37.72,4.88 19.53,4.88 18.74,5.66 9.68,5.66 5.87,9.47 5.87,16.84 5.89,16.84 6.43,17.37 12.9,17.37 13.33,16.94 13.33,10.54 12.7,9.91 11.15,9.91 10.82,9.58 10.82,8.43 11.12,8.13 17.53,8.13 17.7,7.95 23.04,7.95 24.54,6.45 35.56,6.45 39.68,10.57 55.8,10.57 56.87,11.63 63.66,11.63 66.57,14.54 66.57,17.78 67.64,18.85 73.1,18.85 73.33,19.08 73.33,20.68 73.35,20.7 73.35,21.26 73.33,21.28 73.79,21.74 75.62,21.74 75.97,21.39 77.16,21.39 77.67,20.88 77.67,16 80.62,13.06 85.06,13.06 85.17,13.16 85.17,14.74 85.65,15.22 85.65,15.24 86.61,15.24 88.57,17.2
+5V on Inner2: 85.45,8.24 85.45,6.23 85.14,5.92 85.14,1.93 86.37,0.7 90.21,0.7 91.13,1.63 91.13,7.24 93.39,9.5 93.39,15.75 92.1,17.04 88.44,17.04 88.37,17.12 86.51,15.27 85.7,15.27 85.17,14.74 85.17,13.19 84.94,12.95 78.97,12.95 77.19,14.73 77.19,17.7 76.78,18.11 71.58,18.11 70.46,16.99 70.46,11.1 72.95,8.61 85.01,8.61 85.06,8.56 85.13,8.56
+5V on Inner2: 17.12,41.07 17.12,19.42 19.83,16.71 21.3,16.71 22.13,17.54 22.13,19.08 22.4,19.36 23.99,19.36 24.85,18.49 25.5,18.49 25.53,18.52 25.53,18.57 25.63,18.67 25.63,19.2 26.05,19.62 26.54,19.62 26.87,19.95 26.87,21.49 26.39,21.97 26.39,28.02 26.57,28.19 27.64,28.19 27.99,28.55 29.64,28.55 30.02,28.17 30.02,27.56 30.45,27.13 34.21,27.13 34.81,27.73 34.81,28.61 34.09,29.34 34.06,29.34 34.06,29.9 33.81,30.15 31.98,30.15 31.95,30.12 31.14,30.94 26.39,30.94 26.11,31.22 26.06,31.22 26.06,39.17 25.04,40.18 25.04,41.28 25.6,41.83 39.27,41.83 39.57,42.14 50.44,42.14 51.61,43.31 53.16,43.31 53.31,43.15 53.31,41.3 53.56,41.05 54.93,41.05 54.97,41.02 55.4,41.45 55.4,48.18 55.45,48.23 54.18,49.5 50.59,49.5 50.24,49.15 50.24,46.69 47.81,44.26 29.28,44.26 28.8,44.73 28.8,48.25 28.14,48.91 22.54,48.91 21.69,48.06 21.69,43.88 19.29,41.48 17.55,41.48
GND on Bottom Layer: 0.76,53.26 101.91,53.26 109.07,46.1 109.07,-3.1 103.91,-8.25 -0.97,-8.25 -8.13,-1.09 -8.13,44.37
GND on Inner1: -0.71,53.9 102.72,53.9 110.85,45.77 110.85,4.32 102.26,-4.27 -2.29,-4.27 -8.51,1.96 -8.51,46.1
GND on Inner2: -4.7,47.85 -0.31,52.25 -0.31,52.4 -0.28,52.38 103.63,52.38 106.96,49.05 106.96,2.13 100.48,-4.34 -1.04,-4.34 -7.42,2.03 -7.42,45.14
VCC_3.3V on Top Layer: 91.75,23.75 91.75,20.55 91.67,20.47 78.23,20.47 76.48,22.22 73.61,22.22 72.95,21.56 72.95,19.1 72.8,18.95 71.63,18.95 71.3,19.28 71.3,21.74 70.56,22.48 70.56,22.73 68.94,24.36 68.33,24.36 66.7,25.98 63.58,25.98 63.55,25.96 59.69,25.96 59.44,26.21 59.44,30.1 58.8,30.73 56.74,30.73 56.25,30.24 56.25,20.57 56.55,20.27 58.34,20.27 58.42,20.19 58.42,19.83 58.35,19.76 56.44,19.76 56.26,19.94 55.91,19.94 54.79,18.82 54.79,16.76 54.61,16.59 53.87,16.59 53.77,16.69 53.77,18.47 53.97,18.67 53.97,19.2 53.77,19.41 53.16,19.41 53.09,19.33 53.09,18.47 53.24,18.31 53.24,16.66 53.06,16.48 52.86,16.48 52.73,16.61 52.73,18.29 52.63,18.39 52.63,18.42 49.43,18.42 49.25,18.24 49.25,16.66 49.15,16.56 48.87,16.56 48.74,16.69 48.74,18.44 48.92,18.62 48.92,19.08 48.67,19.33 48.18,19.33 47.35,18.49 41.05,18.49 40.74,18.8 40.74,18.87 41.12,19.25 43.34,19.25 43.84,19.75 43.84,30.76 42.9,31.7 41.78,31.7 40.69,32.79 40.69,34.2 40.91,34.42 43.99,34.42 44.27,34.14 44.27,31.64 44.5,31.41 56.2,31.41 56.74,31.95 62.24,31.95 62.48,31.7 62.48,30.2 62.81,29.87 79.96,29.87 82.63,27.2 82.63,26.47 83.6,25.49 83.6,25.06 83.72,24.94 90.55,24.94
VCC_3.3V on Inner1: 43.81,20.05 44.33,19.53 55.09,19.53 55.8,20.24 55.8,30.74 50.93,35.62 50.93,47.37 50.98,47.42 49.3,49.1 46.79,49.1 46.46,48.77 46.46,40.39 42.62,36.55 42.62,34.82 42.22,34.42 40.98,34.42 40.72,34.16 40.72,32.9 40.69,32.87 41.99,31.57 43,31.57 43.75,30.82 43.75,20.13 43.81,20.06
VCC_21V on Top Layer: 22.45,15.11 22.45,17.09 22.63,17.27 23.57,17.27 24.09,17.79 24.59,17.79 24.77,17.97 25.59,17.97 25.68,17.88 25.68,17.53 25.63,17.47 24.59,17.47 24.36,17.25 24.36,16.46 24.56,16.26 30.89,16.26 31.06,16.43 31.06,17.58 31.49,18.01 35.36,18.01 35.62,17.75 35.62,15.3 35.05,14.73 22.83,14.73
VCC_21V on Top Layer: 7.9,27.23 8.15,26.97 8.15,25.37 7.85,25.07 4.04,25.07 3.53,25.58 1.98,25.58 1.5,26.06 1.5,29.31 2.03,29.84 5.79,29.84 6.14,29.49 6.14,27.46 6.38,27.23
VCC_21V on Top Layer: 73.79,42.11 74.04,41.86 75.46,41.86 75.67,42.06 75.67,43.76 76.12,44.22 78.18,44.22 78.64,44.68 78.64,48.08 77.83,48.89 74.6,48.89 74.09,48.39 74.09,44.31 73.8,44.02 73.8,42.38
VCC_21V on Top Layer: 87.22,47.95 87.66,48.39 90.55,48.39 91.31,47.62 91.31,42.34 91.01,42.04 89.84,42.04 89.43,42.44 89.43,43.61 89.15,43.89 87.7,43.89 87.2,44.4 87.2,47.93
VCC_21V on Top Layer: 90.96,27.77 90.96,24.87 91.62,24.21 98.81,24.21 99.03,24.44 99.03,27.94 98.55,28.42 96.03,28.42 95.71,28.09 95.71,28.07 95.68,28.04 91.23,28.04
VCC_21V on Inner2: 73.84,48.48 73.84,41.99 74.09,41.73 76.1,41.73 77.09,40.74 77.09,33.41 75.17,31.5 67.26,31.5 65.26,29.5 56.74,29.5 53.68,26.44 47.09,26.44 38.68,18.03 31.52,18.03 30.99,17.5 30.94,17.5 29.92,16.48 24.84,16.48 24.69,16.33 19.43,16.33 14.86,20.9 8.31,20.9 7.72,21.49 7.72,27.13 7.57,27.28 6.4,27.28 6.14,27.53 6.14,29.09 5.39,29.84 0.8,29.84 0.44,29.49 0.44,26.2 0.88,25.77 3.85,25.77 4.75,24.87 5.77,24.87 6.4,24.23 6.4,20.75 9.04,18.11 13.54,18.11 17.63,14.02 36.86,14.02 47.32,24.49 56.46,24.49 59.13,27.15 67.26,27.15 69.39,29.29 76.96,29.29 82.27,23.98 98.27,23.98 99.42,25.12 99.42,25.37 98.95,25.84 98.95,27.79 98.29,28.45 96.14,28.45 96.01,28.32 91.19,28.32 90.63,27.76 85.87,27.76 82.64,30.99 82.64,40.52 83.98,41.86 90.73,41.86 91.59,42.72 91.59,47.98 90.81,48.77 74.12,48.77

## Text on the board
Bottom Silkscreen Layer: GND | X1 | +5V | HRA | X2 | HRB | HRC | SWCLK | SWDIO | 3.3V | RX | TX | SR3 | +21V | SR2 | SR4 | X0 | SV | SR1 | Y0
